# Altium schematic sheet 0239_GPU GDDR DEVICE DE.SchDoc
size 848 x 558 mm
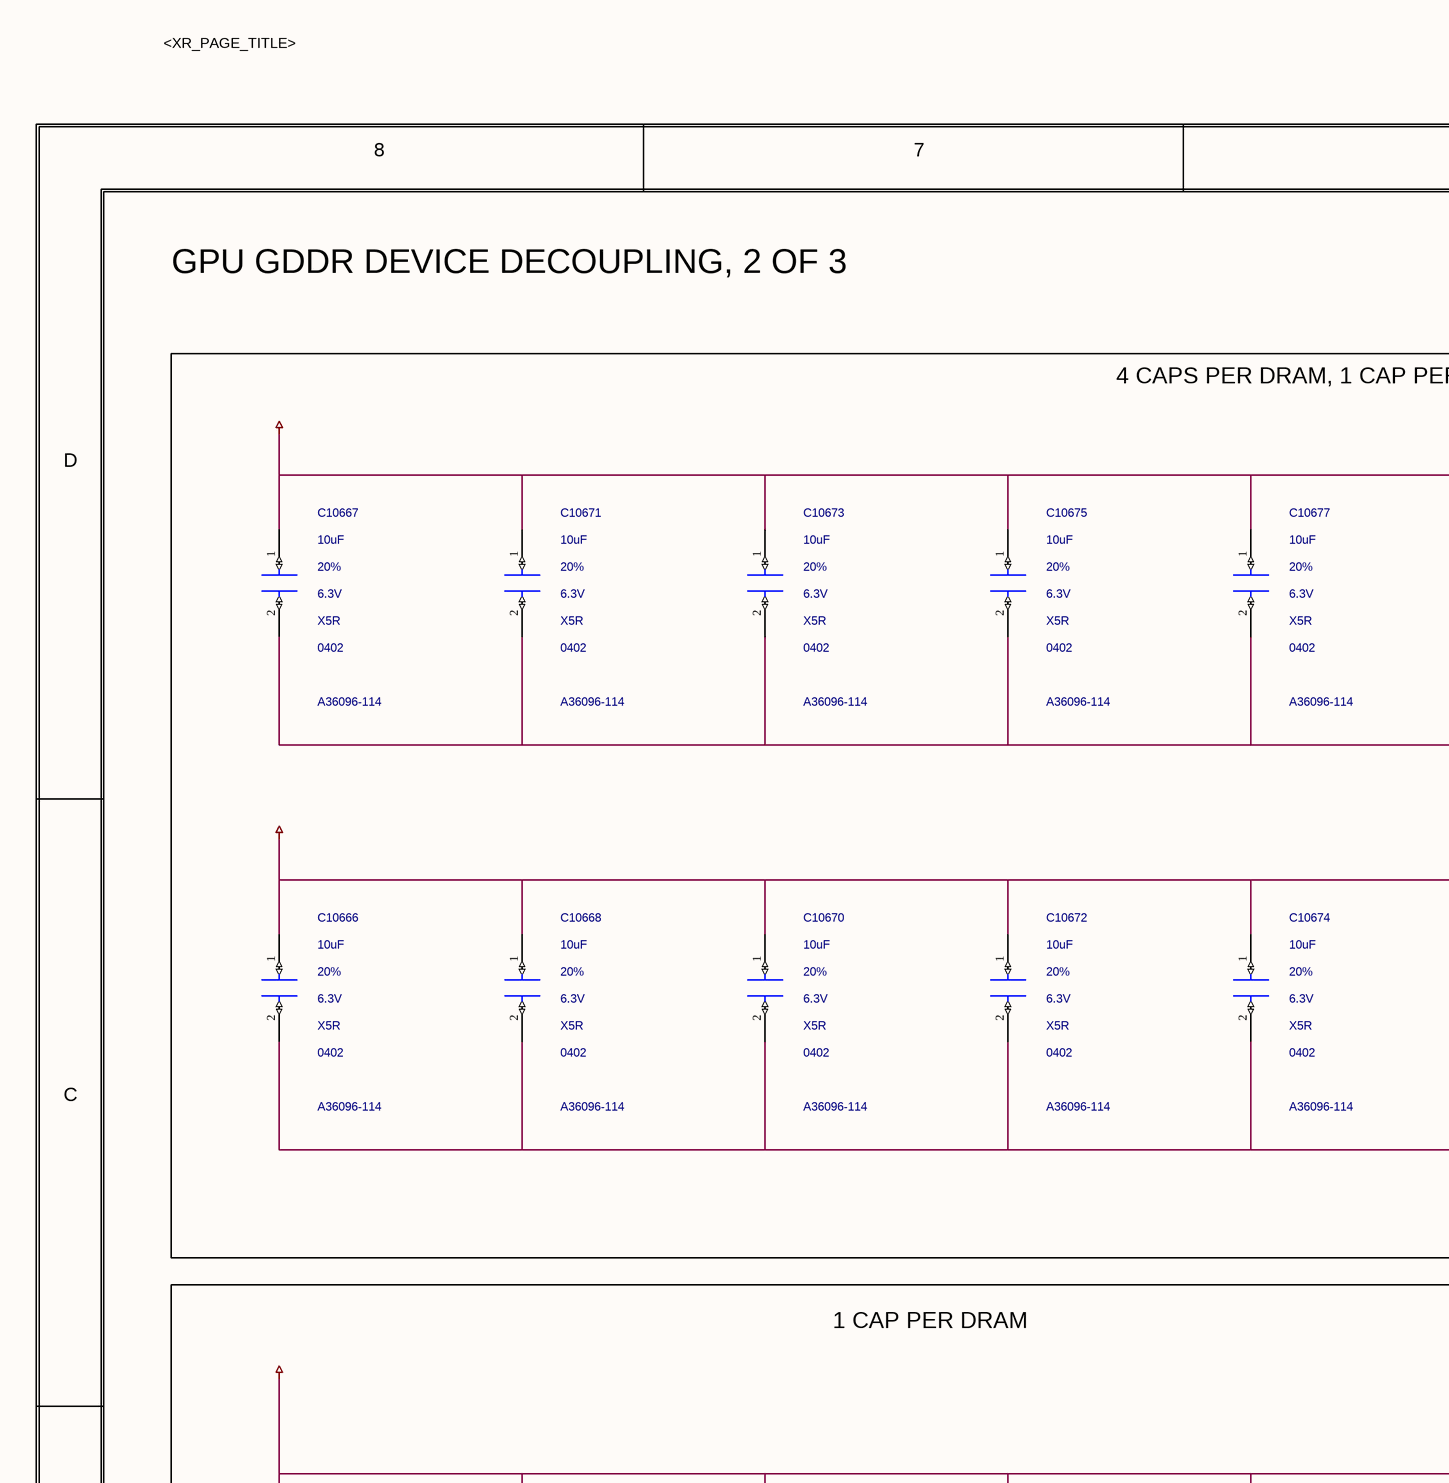
[diagram p0: 0239_GPU GDDR DEVICE DE.SchDoc, top left]
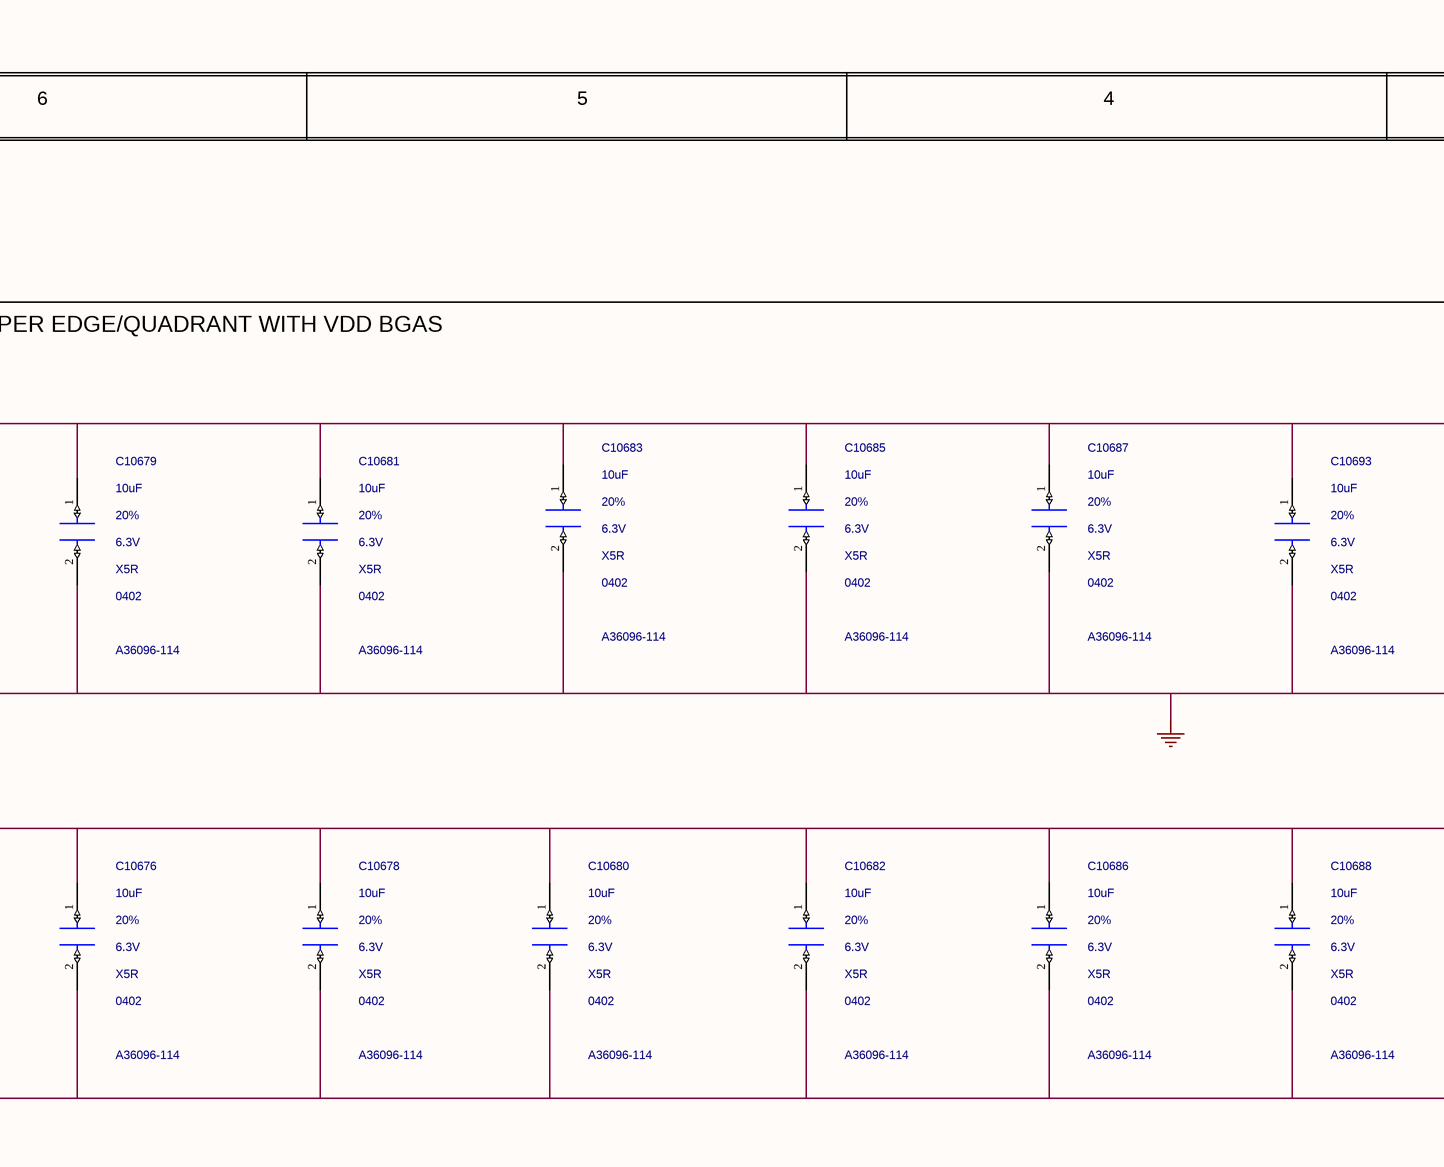
[diagram p1: 0239_GPU GDDR DEVICE DE.SchDoc, top middle]
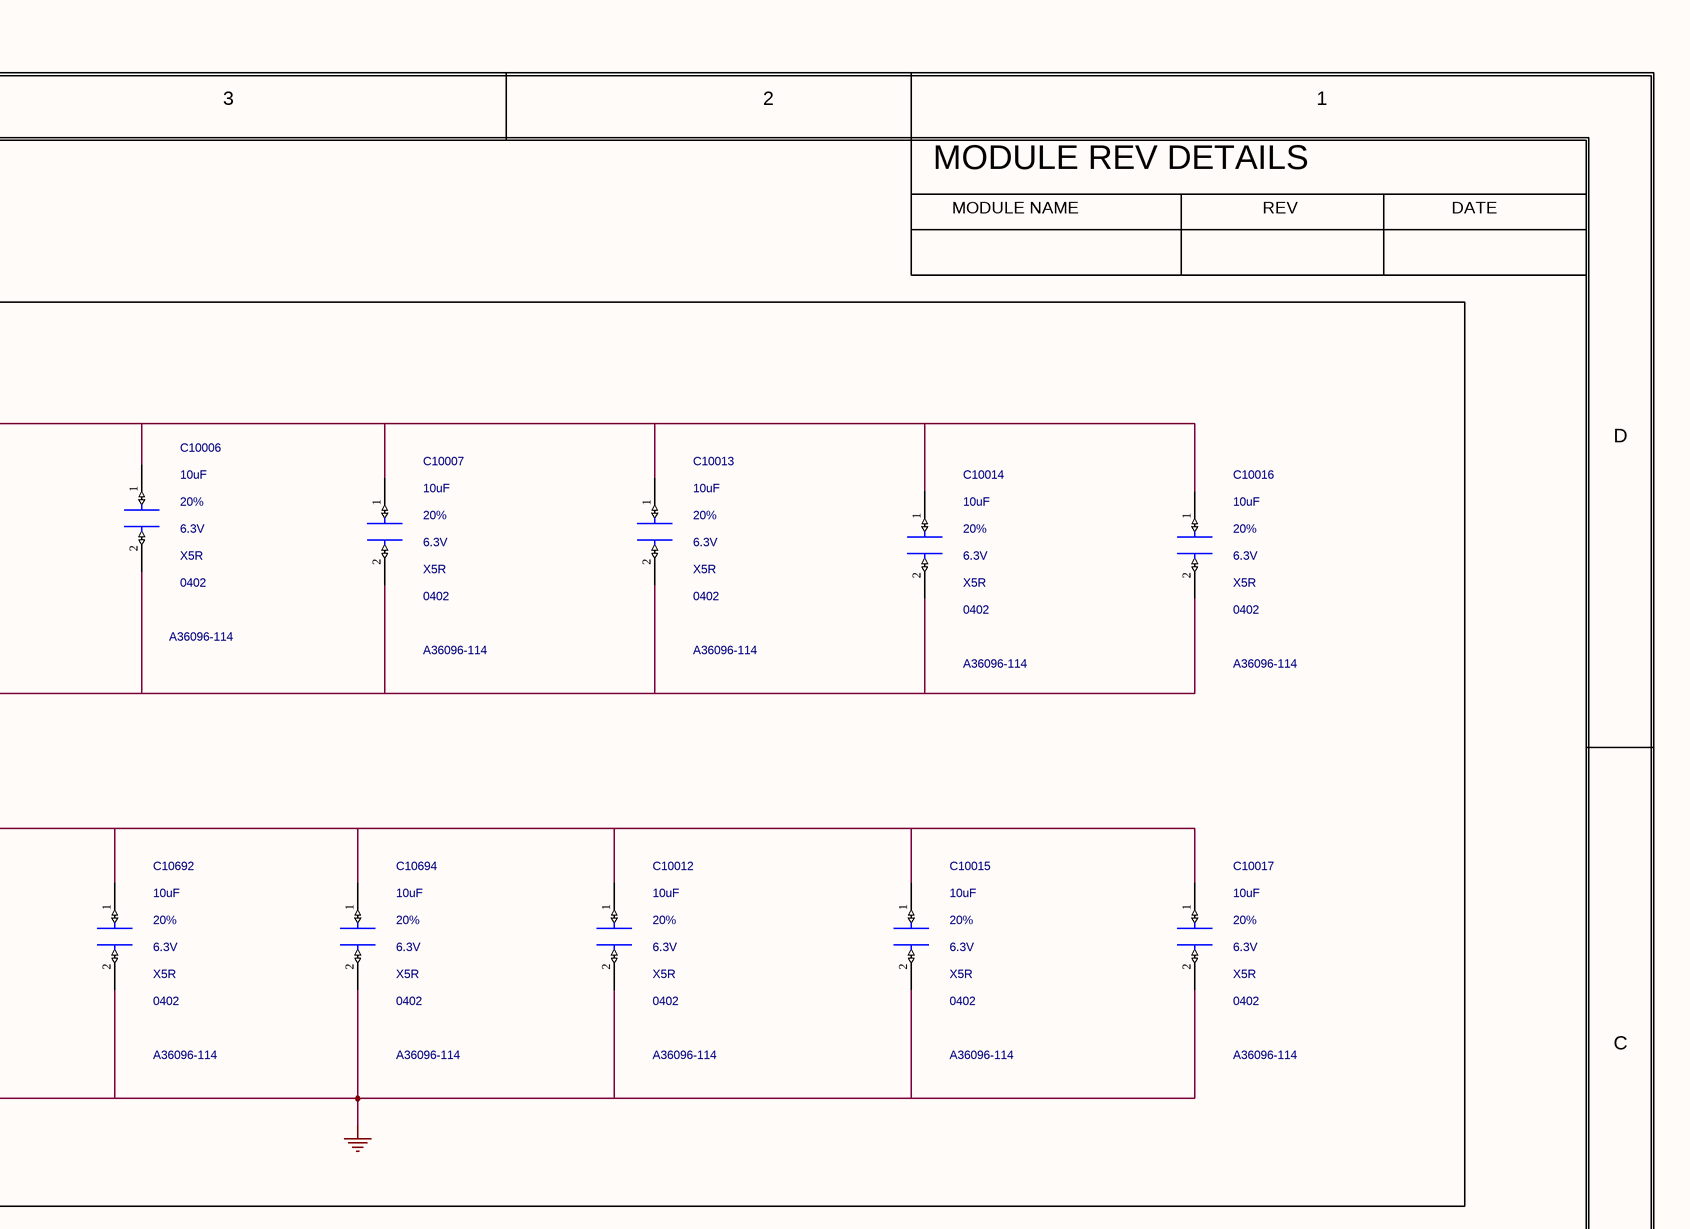
[diagram p2: 0239_GPU GDDR DEVICE DE.SchDoc, top right]
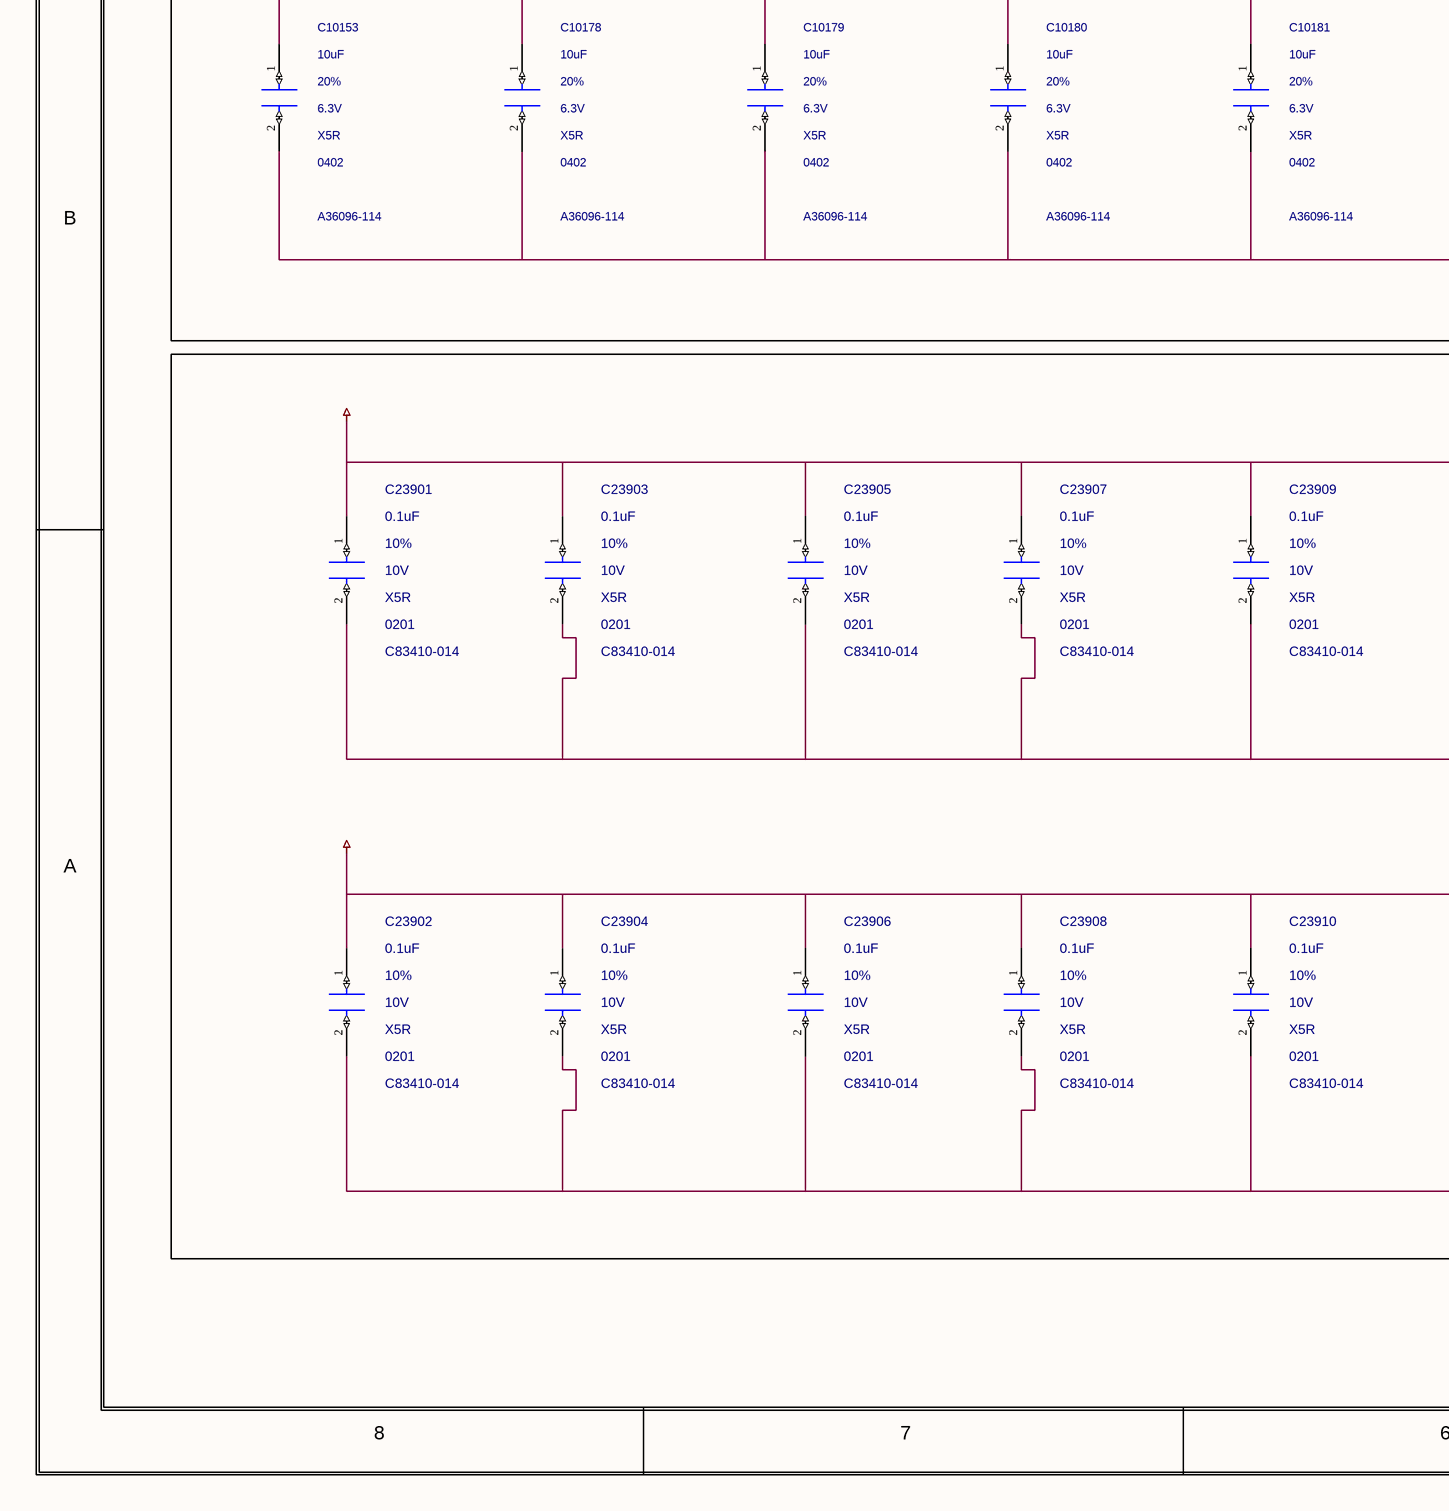
[diagram p3: 0239_GPU GDDR DEVICE DE.SchDoc, bottom left]
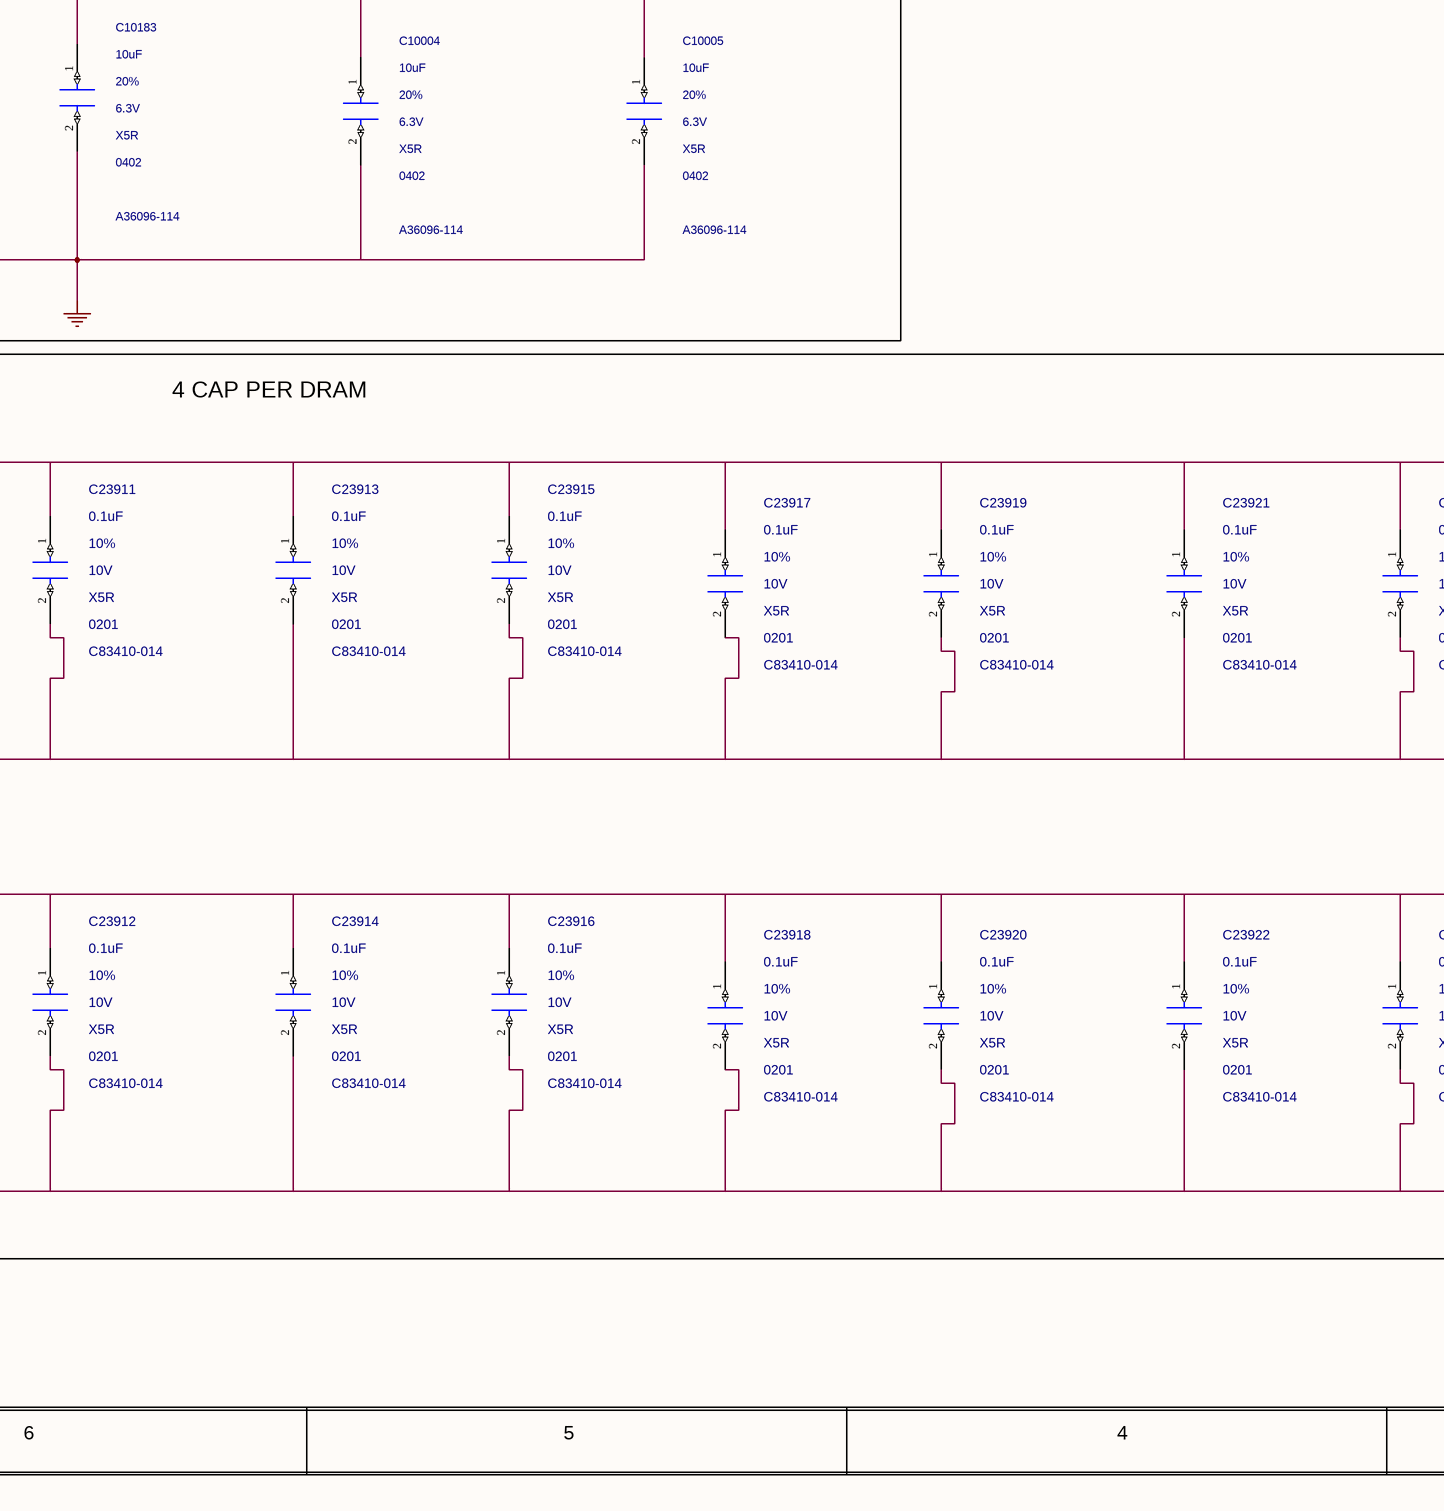
[diagram p4: 0239_GPU GDDR DEVICE DE.SchDoc, bottom middle]
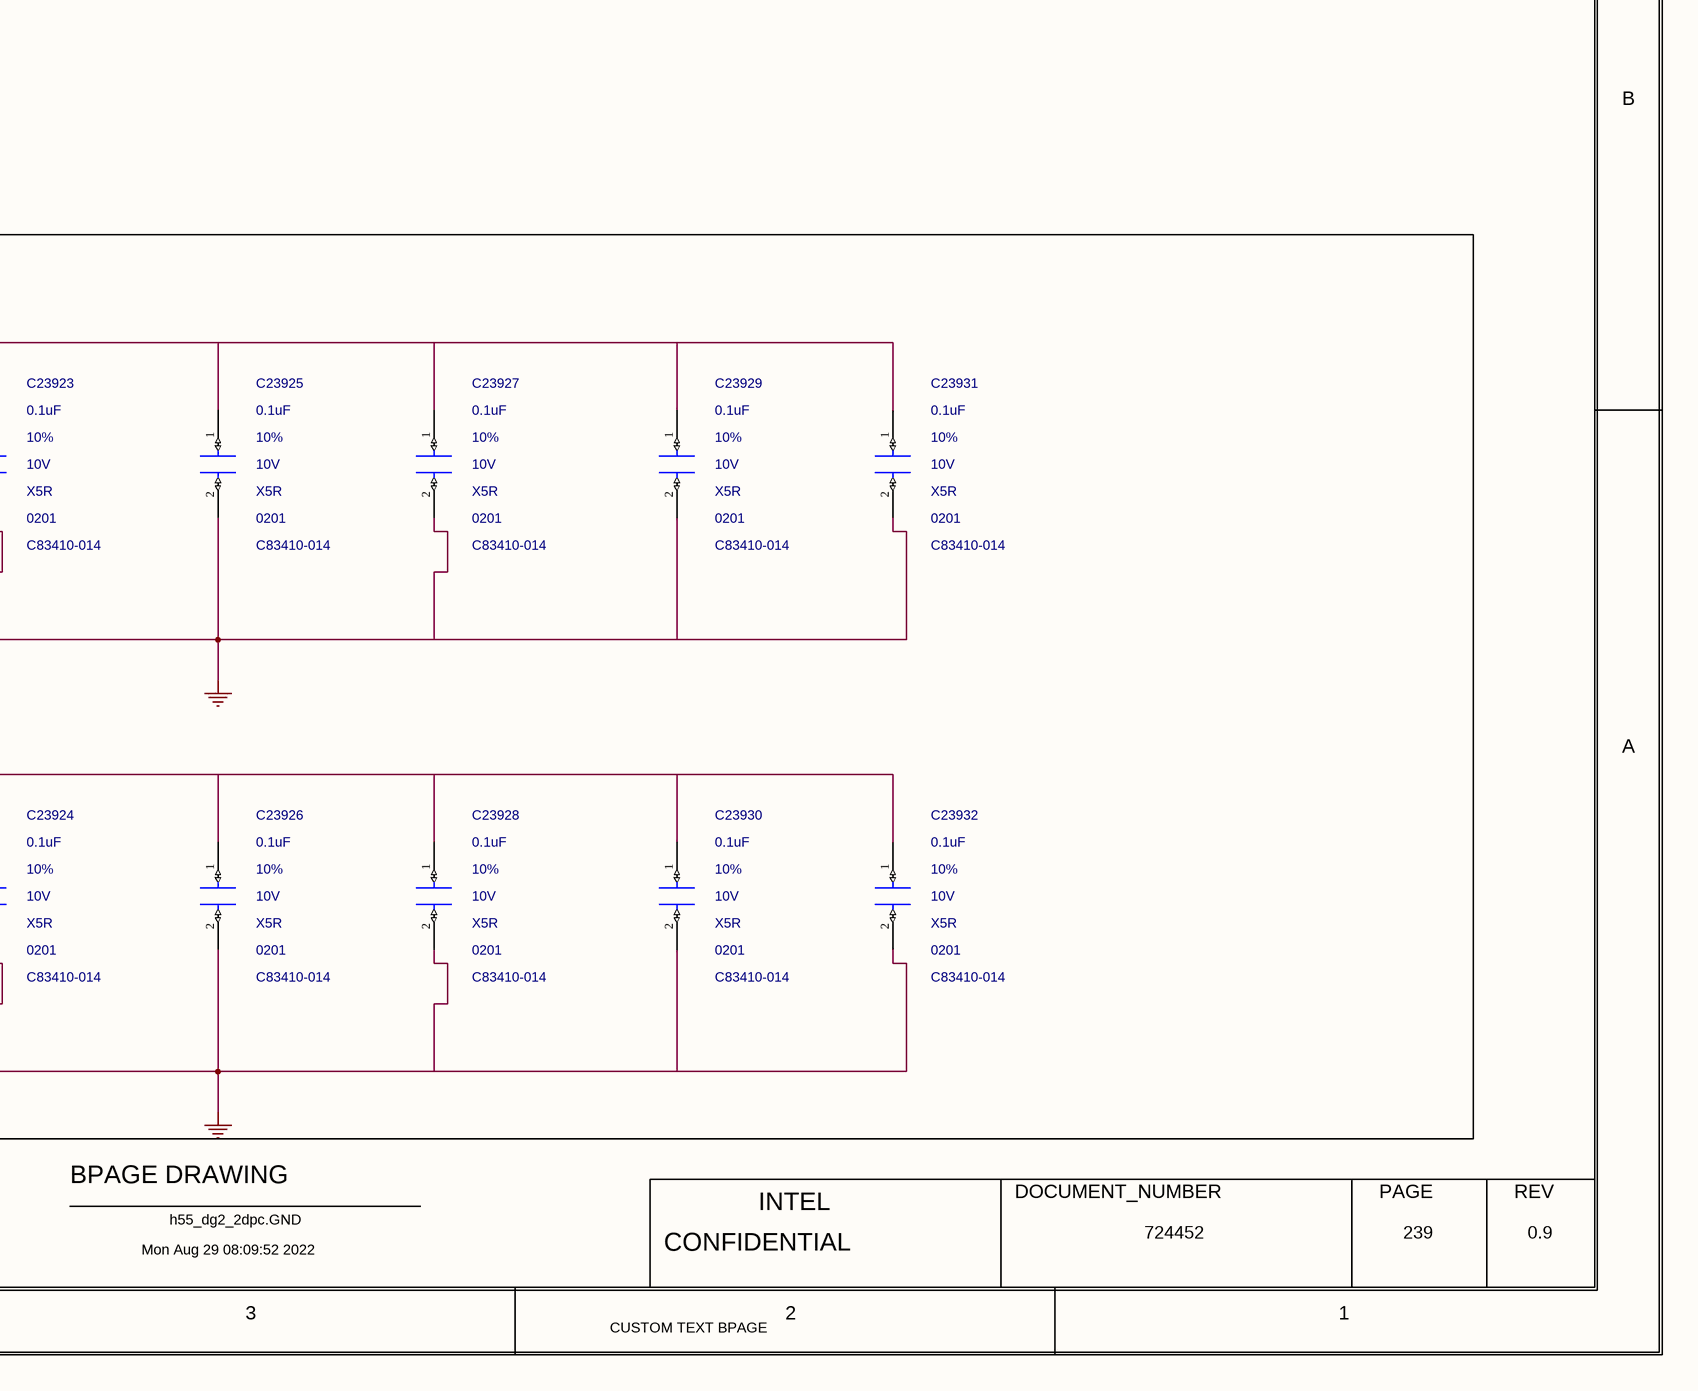
[diagram p5: 0239_GPU GDDR DEVICE DE.SchDoc, bottom right]

## Parts
C10004  10uF  MATERIAL: X5R  PACK_TYPE: 0402  PART_NUMBER: A36096-114  TOLERANCE: 20%  VOLTAGE: 6.3V  [SMC0402IA]
C10005  10uF  MATERIAL: X5R  PACK_TYPE: 0402  PART_NUMBER: A36096-114  TOLERANCE: 20%  VOLTAGE: 6.3V  [SMC0402IA]
C10006  10uF  MATERIAL: X5R  PACK_TYPE: 0402  PART_NUMBER: A36096-114  TOLERANCE: 20%  VOLTAGE: 6.3V  [SMC0402IA]
C10007  10uF  MATERIAL: X5R  PACK_TYPE: 0402  PART_NUMBER: A36096-114  TOLERANCE: 20%  VOLTAGE: 6.3V  [SMC0402IA]
C10012  10uF  MATERIAL: X5R  PACK_TYPE: 0402  PART_NUMBER: A36096-114  TOLERANCE: 20%  VOLTAGE: 6.3V  [SMC0402IA]
C10013  10uF  MATERIAL: X5R  PACK_TYPE: 0402  PART_NUMBER: A36096-114  TOLERANCE: 20%  VOLTAGE: 6.3V  [SMC0402IA]
C10014  10uF  MATERIAL: X5R  PACK_TYPE: 0402  PART_NUMBER: A36096-114  TOLERANCE: 20%  VOLTAGE: 6.3V  [SMC0402IA]
C10015  10uF  MATERIAL: X5R  PACK_TYPE: 0402  PART_NUMBER: A36096-114  TOLERANCE: 20%  VOLTAGE: 6.3V  [SMC0402IA]
C10016  10uF  MATERIAL: X5R  PACK_TYPE: 0402  PART_NUMBER: A36096-114  TOLERANCE: 20%  VOLTAGE: 6.3V  [SMC0402IA]
C10017  10uF  MATERIAL: X5R  PACK_TYPE: 0402  PART_NUMBER: A36096-114  TOLERANCE: 20%  VOLTAGE: 6.3V  [SMC0402IA]
C10153  10uF  MATERIAL: X5R  PACK_TYPE: 0402  PART_NUMBER: A36096-114  TOLERANCE: 20%  VOLTAGE: 6.3V  [SMC0402IA]
C10178  10uF  MATERIAL: X5R  PACK_TYPE: 0402  PART_NUMBER: A36096-114  TOLERANCE: 20%  VOLTAGE: 6.3V  [SMC0402IA]
C10179  10uF  MATERIAL: X5R  PACK_TYPE: 0402  PART_NUMBER: A36096-114  TOLERANCE: 20%  VOLTAGE: 6.3V  [SMC0402IA]
C10180  10uF  MATERIAL: X5R  PACK_TYPE: 0402  PART_NUMBER: A36096-114  TOLERANCE: 20%  VOLTAGE: 6.3V  [SMC0402IA]
C10181  10uF  MATERIAL: X5R  PACK_TYPE: 0402  PART_NUMBER: A36096-114  TOLERANCE: 20%  VOLTAGE: 6.3V  [SMC0402IA]
C10183  10uF  MATERIAL: X5R  PACK_TYPE: 0402  PART_NUMBER: A36096-114  TOLERANCE: 20%  VOLTAGE: 6.3V  [SMC0402IA]
C10666  10uF  MATERIAL: X5R  PACK_TYPE: 0402  PART_NUMBER: A36096-114  TOLERANCE: 20%  VOLTAGE: 6.3V  [SMC0402IA]
C10667  10uF  MATERIAL: X5R  PACK_TYPE: 0402  PART_NUMBER: A36096-114  TOLERANCE: 20%  VOLTAGE: 6.3V  [SMC0402IA]
C10668  10uF  MATERIAL: X5R  PACK_TYPE: 0402  PART_NUMBER: A36096-114  TOLERANCE: 20%  VOLTAGE: 6.3V  [SMC0402IA]
C10670  10uF  MATERIAL: X5R  PACK_TYPE: 0402  PART_NUMBER: A36096-114  TOLERANCE: 20%  VOLTAGE: 6.3V  [SMC0402IA]
C10671  10uF  MATERIAL: X5R  PACK_TYPE: 0402  PART_NUMBER: A36096-114  TOLERANCE: 20%  VOLTAGE: 6.3V  [SMC0402IA]
C10672  10uF  MATERIAL: X5R  PACK_TYPE: 0402  PART_NUMBER: A36096-114  TOLERANCE: 20%  VOLTAGE: 6.3V  [SMC0402IA]
C10673  10uF  MATERIAL: X5R  PACK_TYPE: 0402  PART_NUMBER: A36096-114  TOLERANCE: 20%  VOLTAGE: 6.3V  [SMC0402IA]
C10674  10uF  MATERIAL: X5R  PACK_TYPE: 0402  PART_NUMBER: A36096-114  TOLERANCE: 20%  VOLTAGE: 6.3V  [SMC0402IA]
C10675  10uF  MATERIAL: X5R  PACK_TYPE: 0402  PART_NUMBER: A36096-114  TOLERANCE: 20%  VOLTAGE: 6.3V  [SMC0402IA]
C10676  10uF  MATERIAL: X5R  PACK_TYPE: 0402  PART_NUMBER: A36096-114  TOLERANCE: 20%  VOLTAGE: 6.3V  [SMC0402IA]
C10677  10uF  MATERIAL: X5R  PACK_TYPE: 0402  PART_NUMBER: A36096-114  TOLERANCE: 20%  VOLTAGE: 6.3V  [SMC0402IA]
C10678  10uF  MATERIAL: X5R  PACK_TYPE: 0402  PART_NUMBER: A36096-114  TOLERANCE: 20%  VOLTAGE: 6.3V  [SMC0402IA]
C10679  10uF  MATERIAL: X5R  PACK_TYPE: 0402  PART_NUMBER: A36096-114  TOLERANCE: 20%  VOLTAGE: 6.3V  [SMC0402IA]
C10680  10uF  MATERIAL: X5R  PACK_TYPE: 0402  PART_NUMBER: A36096-114  TOLERANCE: 20%  VOLTAGE: 6.3V  [SMC0402IA]
C10681  10uF  MATERIAL: X5R  PACK_TYPE: 0402  PART_NUMBER: A36096-114  TOLERANCE: 20%  VOLTAGE: 6.3V  [SMC0402IA]
C10682  10uF  MATERIAL: X5R  PACK_TYPE: 0402  PART_NUMBER: A36096-114  TOLERANCE: 20%  VOLTAGE: 6.3V  [SMC0402IA]
C10683  10uF  MATERIAL: X5R  PACK_TYPE: 0402  PART_NUMBER: A36096-114  TOLERANCE: 20%  VOLTAGE: 6.3V  [SMC0402IA]
C10685  10uF  MATERIAL: X5R  PACK_TYPE: 0402  PART_NUMBER: A36096-114  TOLERANCE: 20%  VOLTAGE: 6.3V  [SMC0402IA]
C10686  10uF  MATERIAL: X5R  PACK_TYPE: 0402  PART_NUMBER: A36096-114  TOLERANCE: 20%  VOLTAGE: 6.3V  [SMC0402IA]
C10687  10uF  MATERIAL: X5R  PACK_TYPE: 0402  PART_NUMBER: A36096-114  TOLERANCE: 20%  VOLTAGE: 6.3V  [SMC0402IA]
C10688  10uF  MATERIAL: X5R  PACK_TYPE: 0402  PART_NUMBER: A36096-114  TOLERANCE: 20%  VOLTAGE: 6.3V  [SMC0402IA]
C10692  10uF  MATERIAL: X5R  PACK_TYPE: 0402  PART_NUMBER: A36096-114  TOLERANCE: 20%  VOLTAGE: 6.3V  [SMC0402IA]
C10693  10uF  MATERIAL: X5R  PACK_TYPE: 0402  PART_NUMBER: A36096-114  TOLERANCE: 20%  VOLTAGE: 6.3V  [SMC0402IA]
C10694  10uF  MATERIAL: X5R  PACK_TYPE: 0402  PART_NUMBER: A36096-114  TOLERANCE: 20%  VOLTAGE: 6.3V  [SMC0402IA]
C23901  0.1uF  MATERIAL: X5R  PACK_TYPE: 0201  PART_NUMBER: C83410-014  TOLERANCE: 10%  VOLTAGE: 10V  [SMC0201IA]
C23902  0.1uF  MATERIAL: X5R  PACK_TYPE: 0201  PART_NUMBER: C83410-014  TOLERANCE: 10%  VOLTAGE: 10V  [SMC0201IA]
C23903  0.1uF  MATERIAL: X5R  PACK_TYPE: 0201  PART_NUMBER: C83410-014  TOLERANCE: 10%  VOLTAGE: 10V  [SMC0201IA]
C23904  0.1uF  MATERIAL: X5R  PACK_TYPE: 0201  PART_NUMBER: C83410-014  TOLERANCE: 10%  VOLTAGE: 10V  [SMC0201IA]
C23905  0.1uF  MATERIAL: X5R  PACK_TYPE: 0201  PART_NUMBER: C83410-014  TOLERANCE: 10%  VOLTAGE: 10V  [SMC0201IA]
C23906  0.1uF  MATERIAL: X5R  PACK_TYPE: 0201  PART_NUMBER: C83410-014  TOLERANCE: 10%  VOLTAGE: 10V  [SMC0201IA]
C23907  0.1uF  MATERIAL: X5R  PACK_TYPE: 0201  PART_NUMBER: C83410-014  TOLERANCE: 10%  VOLTAGE: 10V  [SMC0201IA]
C23908  0.1uF  MATERIAL: X5R  PACK_TYPE: 0201  PART_NUMBER: C83410-014  TOLERANCE: 10%  VOLTAGE: 10V  [SMC0201IA]
C23909  0.1uF  MATERIAL: X5R  PACK_TYPE: 0201  PART_NUMBER: C83410-014  TOLERANCE: 10%  VOLTAGE: 10V  [SMC0201IA]
C23910  0.1uF  MATERIAL: X5R  PACK_TYPE: 0201  PART_NUMBER: C83410-014  TOLERANCE: 10%  VOLTAGE: 10V  [SMC0201IA]
C23911  0.1uF  MATERIAL: X5R  PACK_TYPE: 0201  PART_NUMBER: C83410-014  TOLERANCE: 10%  VOLTAGE: 10V  [SMC0201IA]
C23912  0.1uF  MATERIAL: X5R  PACK_TYPE: 0201  PART_NUMBER: C83410-014  TOLERANCE: 10%  VOLTAGE: 10V  [SMC0201IA]
C23913  0.1uF  MATERIAL: X5R  PACK_TYPE: 0201  PART_NUMBER: C83410-014  TOLERANCE: 10%  VOLTAGE: 10V  [SMC0201IA]
C23914  0.1uF  MATERIAL: X5R  PACK_TYPE: 0201  PART_NUMBER: C83410-014  TOLERANCE: 10%  VOLTAGE: 10V  [SMC0201IA]
C23915  0.1uF  MATERIAL: X5R  PACK_TYPE: 0201  PART_NUMBER: C83410-014  TOLERANCE: 10%  VOLTAGE: 10V  [SMC0201IA]
C23916  0.1uF  MATERIAL: X5R  PACK_TYPE: 0201  PART_NUMBER: C83410-014  TOLERANCE: 10%  VOLTAGE: 10V  [SMC0201IA]
C23917  0.1uF  MATERIAL: X5R  PACK_TYPE: 0201  PART_NUMBER: C83410-014  TOLERANCE: 10%  VOLTAGE: 10V  [SMC0201IA]
C23918  0.1uF  MATERIAL: X5R  PACK_TYPE: 0201  PART_NUMBER: C83410-014  TOLERANCE: 10%  VOLTAGE: 10V  [SMC0201IA]
C23919  0.1uF  MATERIAL: X5R  PACK_TYPE: 0201  PART_NUMBER: C83410-014  TOLERANCE: 10%  VOLTAGE: 10V  [SMC0201IA]
C23920  0.1uF  MATERIAL: X5R  PACK_TYPE: 0201  PART_NUMBER: C83410-014  TOLERANCE: 10%  VOLTAGE: 10V  [SMC0201IA]
C23921  0.1uF  MATERIAL: X5R  PACK_TYPE: 0201  PART_NUMBER: C83410-014  TOLERANCE: 10%  VOLTAGE: 10V  [SMC0201IA]
C23922  0.1uF  MATERIAL: X5R  PACK_TYPE: 0201  PART_NUMBER: C83410-014  TOLERANCE: 10%  VOLTAGE: 10V  [SMC0201IA]
C23923  0.1uF  MATERIAL: X5R  PACK_TYPE: 0201  PART_NUMBER: C83410-014  TOLERANCE: 10%  VOLTAGE: 10V  [SMC0201IA]
C23924  0.1uF  MATERIAL: X5R  PACK_TYPE: 0201  PART_NUMBER: C83410-014  TOLERANCE: 10%  VOLTAGE: 10V  [SMC0201IA]
C23925  0.1uF  MATERIAL: X5R  PACK_TYPE: 0201  PART_NUMBER: C83410-014  TOLERANCE: 10%  VOLTAGE: 10V  [SMC0201IA]
C23926  0.1uF  MATERIAL: X5R  PACK_TYPE: 0201  PART_NUMBER: C83410-014  TOLERANCE: 10%  VOLTAGE: 10V  [SMC0201IA]
C23927  0.1uF  MATERIAL: X5R  PACK_TYPE: 0201  PART_NUMBER: C83410-014  TOLERANCE: 10%  VOLTAGE: 10V  [SMC0201IA]
C23928  0.1uF  MATERIAL: X5R  PACK_TYPE: 0201  PART_NUMBER: C83410-014  TOLERANCE: 10%  VOLTAGE: 10V  [SMC0201IA]
C23929  0.1uF  MATERIAL: X5R  PACK_TYPE: 0201  PART_NUMBER: C83410-014  TOLERANCE: 10%  VOLTAGE: 10V  [SMC0201IA]
C23930  0.1uF  MATERIAL: X5R  PACK_TYPE: 0201  PART_NUMBER: C83410-014  TOLERANCE: 10%  VOLTAGE: 10V  [SMC0201IA]
C23931  0.1uF  MATERIAL: X5R  PACK_TYPE: 0201  PART_NUMBER: C83410-014  TOLERANCE: 10%  VOLTAGE: 10V  [SMC0201IA]
C23932  0.1uF  MATERIAL: X5R  PACK_TYPE: 0201  PART_NUMBER: C83410-014  TOLERANCE: 10%  VOLTAGE: 10V  [SMC0201IA]

## Blocks framed on the sheet
4 CAPS PER DRAM, 1 CAP PER EDGE/QUADRANT WITH VDD BGAS: C10006 C10007 C10012-C10017 C10666-C10668 C10670-C10683 C10685-C10688 C10692-C10694
1 CAP PER DRAM: C10004 C10005 C10153 C10178-C10181 C10183
4 CAP PER DRAM: C23901-C23932

## Nets
+V1P8S_GPU: C10004.1(A) C10005.1(A) C10153.1(A) C10178.1(A) C10179.1(A) C10180.1(A) C10181.1(A) C10183.1(A)
+VDD_GDDR6: C10006.1(A) C10007.1(A) C10012.1(A) C10013.1(A) C10014.1(A) C10015.1(A) C10016.1(A) C10017.1(A) C10666.1(A) C10667.1(A) C10668.1(A) C10670.1(A) C10671.1(A) C10672.1(A) C10673.1(A) C10674.1(A) C10675.1(A) C10676.1(A) C10677.1(A) C10678.1(A) C10679.1(A) C10680.1(A) C10681.1(A) C10682.1(A) C10683.1(A) C10685.1(A) C10686.1(A) C10687.1(A) C10688.1(A) C10692.1(A) C10693.1(A) C10694.1(A)
+VDDQ_GPU: C23901.1(A) C23902.1(A) C23903.1(A) C23904.1(A) C23905.1(A) C23906.1(A) C23907.1(A) C23908.1(A) C23909.1(A) C23910.1(A) C23911.1(A) C23912.1(A) C23913.1(A) C23914.1(A) C23915.1(A) C23916.1(A) C23917.1(A) C23918.1(A) C23919.1(A) C23920.1(A) C23921.1(A) C23922.1(A) C23923.1(A) C23924.1(A) C23925.1(A) C23926.1(A) C23927.1(A) C23928.1(A) C23929.1(A) C23930.1(A) C23931.1(A) C23932.1(A)
GND: C10004.2(B) C10005.2(B) C10006.2(B) C10007.2(B) C10012.2(B) C10013.2(B) C10014.2(B) C10015.2(B) C10016.2(B) C10017.2(B) C10153.2(B) C10178.2(B) C10179.2(B) C10180.2(B) C10181.2(B) C10183.2(B) C10666.2(B) C10667.2(B) C10668.2(B) C10670.2(B) C10671.2(B) C10672.2(B) C10673.2(B) C10674.2(B) C10675.2(B) C10676.2(B) C10677.2(B) C10678.2(B) C10679.2(B) C10680.2(B) C10681.2(B) C10682.2(B) C10683.2(B) C10685.2(B) C10686.2(B) C10687.2(B) C10688.2(B) C10692.2(B) C10693.2(B) C10694.2(B) C23901.2(B) C23902.2(B) C23903.2(B) C23904.2(B) C23905.2(B) C23906.2(B) C23907.2(B) C23908.2(B) C23909.2(B) C23910.2(B) C23911.2(B) C23912.2(B) C23913.2(B) C23914.2(B) C23915.2(B) C23916.2(B) C23917.2(B) C23918.2(B) C23919.2(B) C23920.2(B) C23921.2(B) C23922.2(B) C23923.2(B) C23924.2(B) C23925.2(B) C23926.2(B) C23927.2(B) C23928.2(B) C23929.2(B) C23930.2(B) C23931.2(B) C23932.2(B)

## Notes on the sheet
- <XR_PAGE_TITLE>
- 8
- 7
- 6
- 5
- 4
- 3
- 2
- 1
- MODULE REV DETAILS
- GPU GDDR DEVICE DECOUPLING, 2 OF 3
- MODULE NAME
- REV
- DATE
- D
- C
- B
- A
- BPAGE DRAWING
- INTEL
- DOCUMENT_NUMBER
- PAGE
- Mon Aug 29 08:09:52 2022
- h55_dg2_2dpc.GND
- CONFIDENTIAL
- 724452
- 239
- 0.9
- CUSTOM TEXT BPAGE

## Library data of the parts
C10004 = CAP: CDS_PHYS_PART_NAME: CAP_0402-A36096-114,X5R,10UF,6.3V,20%,LPDB,GENERIC; OriginalSymbolOrigin: (-50,25); XY: (-4900,2400); VER: 1; ROT: 0; PHYS_PAGE: 239; LOCATION: C10004; DRAWING: @RVP1_ADL_SB_ADP_S_DDR5_SODIMM_2DPC_LIB.H55_DG2_2DPC(SCH_1):PAGE410; CDS_LIB: discrete; PCB Footprint: SMC0402IA; CHIPS_PART_NAME: CAP; CDS_PART_NAME: CAP_0402-A36096-114,X5R,10UF,6.3V,20%,LPDB,GENERIC; CDS_LOCATION: C10004
C10005 = CAP: CDS_PHYS_PART_NAME: CAP_0402-A36096-114,X5R,10UF,6.3V,20%,LPDB,GENERIC; OriginalSymbolOrigin: (-50,25); XY: (-4375,2400); VER: 1; ROT: 0; PHYS_PAGE: 239; LOCATION: C10005; DRAWING: @RVP1_ADL_SB_ADP_S_DDR5_SODIMM_2DPC_LIB.H55_DG2_2DPC(SCH_1):PAGE410; CDS_LIB: discrete; PCB Footprint: SMC0402IA; CHIPS_PART_NAME: CAP; CDS_PART_NAME: CAP_0402-A36096-114,X5R,10UF,6.3V,20%,LPDB,GENERIC; CDS_LOCATION: C10005
C10006 = CAP: CDS_PHYS_PART_NAME: CAP_0402-A36096-114,X5R,10UF,6.3V,20%,LPDB,GENERIC; OriginalSymbolOrigin: (-50,25); XY: (-2675,4300); VER: 1; ROT: 0; PHYS_PAGE: 239; LOCATION: C10006; DRAWING: @RVP1_ADL_SB_ADP_S_DDR5_SODIMM_2DPC_LIB.H55_DG2_2DPC(SCH_1):PAGE410; CDS_LIB: discrete; PCB Footprint: SMC0402IA; CHIPS_PART_NAME: CAP; CDS_PART_NAME: CAP_0402-A36096-114,X5R,10UF,6.3V,20%,LPDB,GENERIC; CDS_LOCATION: C10006
C10007 = CAP: CDS_PHYS_PART_NAME: CAP_0402-A36096-114,X5R,10UF,6.3V,20%,LPDB,GENERIC; OriginalSymbolOrigin: (-50,25); XY: (-2225,4275); VER: 1; ROT: 0; PHYS_PAGE: 239; LOCATION: C10007; DRAWING: @RVP1_ADL_SB_ADP_S_DDR5_SODIMM_2DPC_LIB.H55_DG2_2DPC(SCH_1):PAGE410; CDS_LIB: discrete; PCB Footprint: SMC0402IA; CHIPS_PART_NAME: CAP; CDS_PART_NAME: CAP_0402-A36096-114,X5R,10UF,6.3V,20%,LPDB,GENERIC; CDS_LOCATION: C10007
C10012 = CAP: CDS_PHYS_PART_NAME: CAP_0402-A36096-114,X5R,10UF,6.3V,20%,LPDB,GENERIC; OriginalSymbolOrigin: (-50,25); XY: (-1800,3525); VER: 1; ROT: 0; PHYS_PAGE: 239; LOCATION: C10012; DRAWING: @RVP1_ADL_SB_ADP_S_DDR5_SODIMM_2DPC_LIB.H55_DG2_2DPC(SCH_1):PAGE410; CDS_LIB: discrete; PCB Footprint: SMC0402IA; CHIPS_PART_NAME: CAP; CDS_PART_NAME: CAP_0402-A36096-114,X5R,10UF,6.3V,20%,LPDB,GENERIC; CDS_LOCATION: C10012
C10013 = CAP: CDS_PHYS_PART_NAME: CAP_0402-A36096-114,X5R,10UF,6.3V,20%,LPDB,GENERIC; OriginalSymbolOrigin: (-50,25); XY: (-1725,4275); VER: 1; ROT: 0; PHYS_PAGE: 239; LOCATION: C10013; DRAWING: @RVP1_ADL_SB_ADP_S_DDR5_SODIMM_2DPC_LIB.H55_DG2_2DPC(SCH_1):PAGE410; CDS_LIB: discrete; PCB Footprint: SMC0402IA; CHIPS_PART_NAME: CAP; CDS_PART_NAME: CAP_0402-A36096-114,X5R,10UF,6.3V,20%,LPDB,GENERIC; CDS_LOCATION: C10013
C10014 = CAP: CDS_PHYS_PART_NAME: CAP_0402-A36096-114,X5R,10UF,6.3V,20%,LPDB,GENERIC; OriginalSymbolOrigin: (-50,25); XY: (-1225,4250); VER: 1; ROT: 0; PHYS_PAGE: 239; LOCATION: C10014; DRAWING: @RVP1_ADL_SB_ADP_S_DDR5_SODIMM_2DPC_LIB.H55_DG2_2DPC(SCH_1):PAGE410; CDS_LIB: discrete; PCB Footprint: SMC0402IA; CHIPS_PART_NAME: CAP; CDS_PART_NAME: CAP_0402-A36096-114,X5R,10UF,6.3V,20%,LPDB,GENERIC; CDS_LOCATION: C10014
C10015 = CAP: CDS_PHYS_PART_NAME: CAP_0402-A36096-114,X5R,10UF,6.3V,20%,LPDB,GENERIC; OriginalSymbolOrigin: (-50,25); XY: (-1250,3525); VER: 1; ROT: 0; PHYS_PAGE: 239; LOCATION: C10015; DRAWING: @RVP1_ADL_SB_ADP_S_DDR5_SODIMM_2DPC_LIB.H55_DG2_2DPC(SCH_1):PAGE410; CDS_LIB: discrete; PCB Footprint: SMC0402IA; CHIPS_PART_NAME: CAP; CDS_PART_NAME: CAP_0402-A36096-114,X5R,10UF,6.3V,20%,LPDB,GENERIC; CDS_LOCATION: C10015
C10016 = CAP: CDS_PHYS_PART_NAME: CAP_0402-A36096-114,X5R,10UF,6.3V,20%,LPDB,GENERIC; OriginalSymbolOrigin: (-50,25); XY: (-725,4250); VER: 1; ROT: 0; PHYS_PAGE: 239; LOCATION: C10016; DRAWING: @RVP1_ADL_SB_ADP_S_DDR5_SODIMM_2DPC_LIB.H55_DG2_2DPC(SCH_1):PAGE410; CDS_LIB: discrete; PCB Footprint: SMC0402IA; CHIPS_PART_NAME: CAP; CDS_PART_NAME: CAP_0402-A36096-114,X5R,10UF,6.3V,20%,LPDB,GENERIC; CDS_LOCATION: C10016
C10017 = CAP: CDS_PHYS_PART_NAME: CAP_0402-A36096-114,X5R,10UF,6.3V,20%,LPDB,GENERIC; OriginalSymbolOrigin: (-50,25); XY: (-725,3525); VER: 1; ROT: 0; PHYS_PAGE: 239; LOCATION: C10017; DRAWING: @RVP1_ADL_SB_ADP_S_DDR5_SODIMM_2DPC_LIB.H55_DG2_2DPC(SCH_1):PAGE410; CDS_LIB: discrete; PCB Footprint: SMC0402IA; CHIPS_PART_NAME: CAP; CDS_PART_NAME: CAP_0402-A36096-114,X5R,10UF,6.3V,20%,LPDB,GENERIC; CDS_LOCATION: C10017
C10153 = CAP: CDS_PHYS_PART_NAME: CAP_0402-A36096-114,X5R,10UF,6.3V,20%,LPDB,GENERIC; OriginalSymbolOrigin: (-50,25); XY: (-7675,2425); VER: 1; ROT: 0; PHYS_PAGE: 239; LOCATION: C10153; DRAWING: @RVP1_ADL_SB_ADP_S_DDR5_SODIMM_2DPC_LIB.H55_DG2_2DPC(SCH_1):PAGE410; CDS_LIB: discrete; PCB Footprint: SMC0402IA; CHIPS_PART_NAME: CAP; CDS_PART_NAME: CAP_0402-A36096-114,X5R,10UF,6.3V,20%,LPDB,GENERIC; CDS_LOCATION: C10153
C10178 = CAP: CDS_PHYS_PART_NAME: CAP_0402-A36096-114,X5R,10UF,6.3V,20%,LPDB,GENERIC; OriginalSymbolOrigin: (-50,25); XY: (-7225,2425); VER: 1; ROT: 0; PHYS_PAGE: 239; LOCATION: C10178; DRAWING: @RVP1_ADL_SB_ADP_S_DDR5_SODIMM_2DPC_LIB.H55_DG2_2DPC(SCH_1):PAGE410; CDS_LIB: discrete; PCB Footprint: SMC0402IA; CHIPS_PART_NAME: CAP; CDS_PART_NAME: CAP_0402-A36096-114,X5R,10UF,6.3V,20%,LPDB,GENERIC; CDS_LOCATION: C10178
C10179 = CAP: CDS_PHYS_PART_NAME: CAP_0402-A36096-114,X5R,10UF,6.3V,20%,LPDB,GENERIC; OriginalSymbolOrigin: (-50,25); XY: (-6775,2425); VER: 1; ROT: 0; PHYS_PAGE: 239; LOCATION: C10179; DRAWING: @RVP1_ADL_SB_ADP_S_DDR5_SODIMM_2DPC_LIB.H55_DG2_2DPC(SCH_1):PAGE410; CDS_LIB: discrete; PCB Footprint: SMC0402IA; CHIPS_PART_NAME: CAP; CDS_PART_NAME: CAP_0402-A36096-114,X5R,10UF,6.3V,20%,LPDB,GENERIC; CDS_LOCATION: C10179
C10180 = CAP: CDS_PHYS_PART_NAME: CAP_0402-A36096-114,X5R,10UF,6.3V,20%,LPDB,GENERIC; OriginalSymbolOrigin: (-50,25); XY: (-6325,2425); VER: 1; ROT: 0; PHYS_PAGE: 239; LOCATION: C10180; DRAWING: @RVP1_ADL_SB_ADP_S_DDR5_SODIMM_2DPC_LIB.H55_DG2_2DPC(SCH_1):PAGE410; CDS_LIB: discrete; PCB Footprint: SMC0402IA; CHIPS_PART_NAME: CAP; CDS_PART_NAME: CAP_0402-A36096-114,X5R,10UF,6.3V,20%,LPDB,GENERIC; CDS_LOCATION: C10180
C10181 = CAP: CDS_PHYS_PART_NAME: CAP_0402-A36096-114,X5R,10UF,6.3V,20%,LPDB,GENERIC; OriginalSymbolOrigin: (-50,25); XY: (-5875,2425); VER: 1; ROT: 0; PHYS_PAGE: 239; LOCATION: C10181; DRAWING: @RVP1_ADL_SB_ADP_S_DDR5_SODIMM_2DPC_LIB.H55_DG2_2DPC(SCH_1):PAGE410; CDS_LIB: discrete; PCB Footprint: SMC0402IA; CHIPS_PART_NAME: CAP; CDS_PART_NAME: CAP_0402-A36096-114,X5R,10UF,6.3V,20%,LPDB,GENERIC; CDS_LOCATION: C10181
C10183 = CAP: CDS_PHYS_PART_NAME: CAP_0402-A36096-114,X5R,10UF,6.3V,20%,LPDB,GENERIC; OriginalSymbolOrigin: (-50,25); XY: (-5425,2425); VER: 1; ROT: 0; PHYS_PAGE: 239; LOCATION: C10183; DRAWING: @RVP1_ADL_SB_ADP_S_DDR5_SODIMM_2DPC_LIB.H55_DG2_2DPC(SCH_1):PAGE410; CDS_LIB: discrete; PCB Footprint: SMC0402IA; CHIPS_PART_NAME: CAP; CDS_PART_NAME: CAP_0402-A36096-114,X5R,10UF,6.3V,20%,LPDB,GENERIC; CDS_LOCATION: C10183
C10666 = CAP: CDS_PHYS_PART_NAME: CAP_0402-A36096-114,X5R,10UF,6.3V,20%,LPDB,GENERIC; OriginalSymbolOrigin: (-50,25); XY: (-7675,3525); VER: 1; ROT: 0; PHYS_PAGE: 239; LOCATION: C10666; DRAWING: @RVP1_ADL_SB_ADP_S_DDR5_SODIMM_2DPC_LIB.H55_DG2_2DPC(SCH_1):PAGE410; CDS_LIB: discrete; PCB Footprint: SMC0402IA; CHIPS_PART_NAME: CAP; CDS_PART_NAME: CAP_0402-A36096-114,X5R,10UF,6.3V,20%,LPDB,GENERIC; CDS_LOCATION: C10666
C10667 = CAP: CDS_PHYS_PART_NAME: CAP_0402-A36096-114,X5R,10UF,6.3V,20%,LPDB,GENERIC; OriginalSymbolOrigin: (-50,25); XY: (-7675,4275); VER: 1; ROT: 0; PHYS_PAGE: 239; LOCATION: C10667; DRAWING: @RVP1_ADL_SB_ADP_S_DDR5_SODIMM_2DPC_LIB.H55_DG2_2DPC(SCH_1):PAGE410; CDS_LIB: discrete; PCB Footprint: SMC0402IA; CHIPS_PART_NAME: CAP; CDS_PART_NAME: CAP_0402-A36096-114,X5R,10UF,6.3V,20%,LPDB,GENERIC; CDS_LOCATION: C10667
C10668 = CAP: CDS_PHYS_PART_NAME: CAP_0402-A36096-114,X5R,10UF,6.3V,20%,LPDB,GENERIC; OriginalSymbolOrigin: (-50,25); XY: (-7225,3525); VER: 1; ROT: 0; PHYS_PAGE: 239; LOCATION: C10668; DRAWING: @RVP1_ADL_SB_ADP_S_DDR5_SODIMM_2DPC_LIB.H55_DG2_2DPC(SCH_1):PAGE410; CDS_LIB: discrete; PCB Footprint: SMC0402IA; CHIPS_PART_NAME: CAP; CDS_PART_NAME: CAP_0402-A36096-114,X5R,10UF,6.3V,20%,LPDB,GENERIC; CDS_LOCATION: C10668
C10670 = CAP: CDS_PHYS_PART_NAME: CAP_0402-A36096-114,X5R,10UF,6.3V,20%,LPDB,GENERIC; OriginalSymbolOrigin: (-50,25); XY: (-6775,3525); VER: 1; ROT: 0; PHYS_PAGE: 239; LOCATION: C10670; DRAWING: @RVP1_ADL_SB_ADP_S_DDR5_SODIMM_2DPC_LIB.H55_DG2_2DPC(SCH_1):PAGE410; CDS_LIB: discrete; PCB Footprint: SMC0402IA; CHIPS_PART_NAME: CAP; CDS_PART_NAME: CAP_0402-A36096-114,X5R,10UF,6.3V,20%,LPDB,GENERIC; CDS_LOCATION: C10670
C10671 = CAP: CDS_PHYS_PART_NAME: CAP_0402-A36096-114,X5R,10UF,6.3V,20%,LPDB,GENERIC; OriginalSymbolOrigin: (-50,25); XY: (-7225,4275); VER: 1; ROT: 0; PHYS_PAGE: 239; LOCATION: C10671; DRAWING: @RVP1_ADL_SB_ADP_S_DDR5_SODIMM_2DPC_LIB.H55_DG2_2DPC(SCH_1):PAGE410; CDS_LIB: discrete; PCB Footprint: SMC0402IA; CHIPS_PART_NAME: CAP; CDS_PART_NAME: CAP_0402-A36096-114,X5R,10UF,6.3V,20%,LPDB,GENERIC; CDS_LOCATION: C10671
C10672 = CAP: CDS_PHYS_PART_NAME: CAP_0402-A36096-114,X5R,10UF,6.3V,20%,LPDB,GENERIC; OriginalSymbolOrigin: (-50,25); XY: (-6325,3525); VER: 1; ROT: 0; PHYS_PAGE: 239; LOCATION: C10672; DRAWING: @RVP1_ADL_SB_ADP_S_DDR5_SODIMM_2DPC_LIB.H55_DG2_2DPC(SCH_1):PAGE410; CDS_LIB: discrete; PCB Footprint: SMC0402IA; CHIPS_PART_NAME: CAP; CDS_PART_NAME: CAP_0402-A36096-114,X5R,10UF,6.3V,20%,LPDB,GENERIC; CDS_LOCATION: C10672
C10673 = CAP: CDS_PHYS_PART_NAME: CAP_0402-A36096-114,X5R,10UF,6.3V,20%,LPDB,GENERIC; OriginalSymbolOrigin: (-50,25); XY: (-6775,4275); VER: 1; ROT: 0; PHYS_PAGE: 239; LOCATION: C10673; DRAWING: @RVP1_ADL_SB_ADP_S_DDR5_SODIMM_2DPC_LIB.H55_DG2_2DPC(SCH_1):PAGE410; CDS_LIB: discrete; PCB Footprint: SMC0402IA; CHIPS_PART_NAME: CAP; CDS_PART_NAME: CAP_0402-A36096-114,X5R,10UF,6.3V,20%,LPDB,GENERIC; CDS_LOCATION: C10673
C10674 = CAP: CDS_PHYS_PART_NAME: CAP_0402-A36096-114,X5R,10UF,6.3V,20%,LPDB,GENERIC; OriginalSymbolOrigin: (-50,25); XY: (-5875,3525); VER: 1; ROT: 0; PHYS_PAGE: 239; LOCATION: C10674; DRAWING: @RVP1_ADL_SB_ADP_S_DDR5_SODIMM_2DPC_LIB.H55_DG2_2DPC(SCH_1):PAGE410; CDS_LIB: discrete; PCB Footprint: SMC0402IA; CHIPS_PART_NAME: CAP; CDS_PART_NAME: CAP_0402-A36096-114,X5R,10UF,6.3V,20%,LPDB,GENERIC; CDS_LOCATION: C10674
C10675 = CAP: CDS_PHYS_PART_NAME: CAP_0402-A36096-114,X5R,10UF,6.3V,20%,LPDB,GENERIC; OriginalSymbolOrigin: (-50,25); XY: (-6325,4275); VER: 1; ROT: 0; PHYS_PAGE: 239; LOCATION: C10675; DRAWING: @RVP1_ADL_SB_ADP_S_DDR5_SODIMM_2DPC_LIB.H55_DG2_2DPC(SCH_1):PAGE410; CDS_LIB: discrete; PCB Footprint: SMC0402IA; CHIPS_PART_NAME: CAP; CDS_PART_NAME: CAP_0402-A36096-114,X5R,10UF,6.3V,20%,LPDB,GENERIC; CDS_LOCATION: C10675
C10676 = CAP: CDS_PHYS_PART_NAME: CAP_0402-A36096-114,X5R,10UF,6.3V,20%,LPDB,GENERIC; OriginalSymbolOrigin: (-50,25); XY: (-5425,3525); VER: 1; ROT: 0; PHYS_PAGE: 239; LOCATION: C10676; DRAWING: @RVP1_ADL_SB_ADP_S_DDR5_SODIMM_2DPC_LIB.H55_DG2_2DPC(SCH_1):PAGE410; CDS_LIB: discrete; PCB Footprint: SMC0402IA; CHIPS_PART_NAME: CAP; CDS_PART_NAME: CAP_0402-A36096-114,X5R,10UF,6.3V,20%,LPDB,GENERIC; CDS_LOCATION: C10676
C10677 = CAP: CDS_PHYS_PART_NAME: CAP_0402-A36096-114,X5R,10UF,6.3V,20%,LPDB,GENERIC; OriginalSymbolOrigin: (-50,25); XY: (-5875,4275); VER: 1; ROT: 0; PHYS_PAGE: 239; LOCATION: C10677; DRAWING: @RVP1_ADL_SB_ADP_S_DDR5_SODIMM_2DPC_LIB.H55_DG2_2DPC(SCH_1):PAGE410; CDS_LIB: discrete; PCB Footprint: SMC0402IA; CHIPS_PART_NAME: CAP; CDS_PART_NAME: CAP_0402-A36096-114,X5R,10UF,6.3V,20%,LPDB,GENERIC; CDS_LOCATION: C10677
C10678 = CAP: CDS_PHYS_PART_NAME: CAP_0402-A36096-114,X5R,10UF,6.3V,20%,LPDB,GENERIC; OriginalSymbolOrigin: (-50,25); XY: (-4975,3525); VER: 1; ROT: 0; PHYS_PAGE: 239; LOCATION: C10678; DRAWING: @RVP1_ADL_SB_ADP_S_DDR5_SODIMM_2DPC_LIB.H55_DG2_2DPC(SCH_1):PAGE410; CDS_LIB: discrete; PCB Footprint: SMC0402IA; CHIPS_PART_NAME: CAP; CDS_PART_NAME: CAP_0402-A36096-114,X5R,10UF,6.3V,20%,LPDB,GENERIC; CDS_LOCATION: C10678
C10679 = CAP: CDS_PHYS_PART_NAME: CAP_0402-A36096-114,X5R,10UF,6.3V,20%,LPDB,GENERIC; OriginalSymbolOrigin: (-50,25); XY: (-5425,4275); VER: 1; ROT: 0; PHYS_PAGE: 239; LOCATION: C10679; DRAWING: @RVP1_ADL_SB_ADP_S_DDR5_SODIMM_2DPC_LIB.H55_DG2_2DPC(SCH_1):PAGE410; CDS_LIB: discrete; PCB Footprint: SMC0402IA; CHIPS_PART_NAME: CAP; CDS_PART_NAME: CAP_0402-A36096-114,X5R,10UF,6.3V,20%,LPDB,GENERIC; CDS_LOCATION: C10679
C10680 = CAP: CDS_PHYS_PART_NAME: CAP_0402-A36096-114,X5R,10UF,6.3V,20%,LPDB,GENERIC; OriginalSymbolOrigin: (-50,25); XY: (-4550,3525); VER: 1; ROT: 0; PHYS_PAGE: 239; LOCATION: C10680; DRAWING: @RVP1_ADL_SB_ADP_S_DDR5_SODIMM_2DPC_LIB.H55_DG2_2DPC(SCH_1):PAGE410; CDS_LIB: discrete; PCB Footprint: SMC0402IA; CHIPS_PART_NAME: CAP; CDS_PART_NAME: CAP_0402-A36096-114,X5R,10UF,6.3V,20%,LPDB,GENERIC; CDS_LOCATION: C10680
C10681 = CAP: CDS_PHYS_PART_NAME: CAP_0402-A36096-114,X5R,10UF,6.3V,20%,LPDB,GENERIC; OriginalSymbolOrigin: (-50,25); XY: (-4975,4275); VER: 1; ROT: 0; PHYS_PAGE: 239; LOCATION: C10681; DRAWING: @RVP1_ADL_SB_ADP_S_DDR5_SODIMM_2DPC_LIB.H55_DG2_2DPC(SCH_1):PAGE410; CDS_LIB: discrete; PCB Footprint: SMC0402IA; CHIPS_PART_NAME: CAP; CDS_PART_NAME: CAP_0402-A36096-114,X5R,10UF,6.3V,20%,LPDB,GENERIC; CDS_LOCATION: C10681
C10682 = CAP: CDS_PHYS_PART_NAME: CAP_0402-A36096-114,X5R,10UF,6.3V,20%,LPDB,GENERIC; OriginalSymbolOrigin: (-50,25); XY: (-4075,3525); VER: 1; ROT: 0; PHYS_PAGE: 239; LOCATION: C10682; DRAWING: @RVP1_ADL_SB_ADP_S_DDR5_SODIMM_2DPC_LIB.H55_DG2_2DPC(SCH_1):PAGE410; CDS_LIB: discrete; PCB Footprint: SMC0402IA; CHIPS_PART_NAME: CAP; CDS_PART_NAME: CAP_0402-A36096-114,X5R,10UF,6.3V,20%,LPDB,GENERIC; CDS_LOCATION: C10682
C10683 = CAP: CDS_PHYS_PART_NAME: CAP_0402-A36096-114,X5R,10UF,6.3V,20%,LPDB,GENERIC; OriginalSymbolOrigin: (-50,25); XY: (-4525,4300); VER: 1; ROT: 0; PHYS_PAGE: 239; LOCATION: C10683; DRAWING: @RVP1_ADL_SB_ADP_S_DDR5_SODIMM_2DPC_LIB.H55_DG2_2DPC(SCH_1):PAGE410; CDS_LIB: discrete; PCB Footprint: SMC0402IA; CHIPS_PART_NAME: CAP; CDS_PART_NAME: CAP_0402-A36096-114,X5R,10UF,6.3V,20%,LPDB,GENERIC; CDS_LOCATION: C10683
C10685 = CAP: CDS_PHYS_PART_NAME: CAP_0402-A36096-114,X5R,10UF,6.3V,20%,LPDB,GENERIC; OriginalSymbolOrigin: (-50,25); XY: (-4075,4300); VER: 1; ROT: 0; PHYS_PAGE: 239; LOCATION: C10685; DRAWING: @RVP1_ADL_SB_ADP_S_DDR5_SODIMM_2DPC_LIB.H55_DG2_2DPC(SCH_1):PAGE410; CDS_LIB: discrete; PCB Footprint: SMC0402IA; CHIPS_PART_NAME: CAP; CDS_PART_NAME: CAP_0402-A36096-114,X5R,10UF,6.3V,20%,LPDB,GENERIC; CDS_LOCATION: C10685
C10686 = CAP: CDS_PHYS_PART_NAME: CAP_0402-A36096-114,X5R,10UF,6.3V,20%,LPDB,GENERIC; OriginalSymbolOrigin: (-50,25); XY: (-3625,3525); VER: 1; ROT: 0; PHYS_PAGE: 239; LOCATION: C10686; DRAWING: @RVP1_ADL_SB_ADP_S_DDR5_SODIMM_2DPC_LIB.H55_DG2_2DPC(SCH_1):PAGE410; CDS_LIB: discrete; PCB Footprint: SMC0402IA; CHIPS_PART_NAME: CAP; CDS_PART_NAME: CAP_0402-A36096-114,X5R,10UF,6.3V,20%,LPDB,GENERIC; CDS_LOCATION: C10686
C10687 = CAP: CDS_PHYS_PART_NAME: CAP_0402-A36096-114,X5R,10UF,6.3V,20%,LPDB,GENERIC; OriginalSymbolOrigin: (-50,25); XY: (-3625,4300); VER: 1; ROT: 0; PHYS_PAGE: 239; LOCATION: C10687; DRAWING: @RVP1_ADL_SB_ADP_S_DDR5_SODIMM_2DPC_LIB.H55_DG2_2DPC(SCH_1):PAGE410; CDS_LIB: discrete; PCB Footprint: SMC0402IA; CHIPS_PART_NAME: CAP; CDS_PART_NAME: CAP_0402-A36096-114,X5R,10UF,6.3V,20%,LPDB,GENERIC; CDS_LOCATION: C10687
C10688 = CAP: CDS_PHYS_PART_NAME: CAP_0402-A36096-114,X5R,10UF,6.3V,20%,LPDB,GENERIC; OriginalSymbolOrigin: (-50,25); XY: (-3175,3525); VER: 1; ROT: 0; PHYS_PAGE: 239; LOCATION: C10688; DRAWING: @RVP1_ADL_SB_ADP_S_DDR5_SODIMM_2DPC_LIB.H55_DG2_2DPC(SCH_1):PAGE410; CDS_LIB: discrete; PCB Footprint: SMC0402IA; CHIPS_PART_NAME: CAP; CDS_PART_NAME: CAP_0402-A36096-114,X5R,10UF,6.3V,20%,LPDB,GENERIC; CDS_LOCATION: C10688
C10692 = CAP: CDS_PHYS_PART_NAME: CAP_0402-A36096-114,X5R,10UF,6.3V,20%,LPDB,GENERIC; OriginalSymbolOrigin: (-50,25); XY: (-2725,3525); VER: 1; ROT: 0; PHYS_PAGE: 239; LOCATION: C10692; DRAWING: @RVP1_ADL_SB_ADP_S_DDR5_SODIMM_2DPC_LIB.H55_DG2_2DPC(SCH_1):PAGE410; CDS_LIB: discrete; PCB Footprint: SMC0402IA; CHIPS_PART_NAME: CAP; CDS_PART_NAME: CAP_0402-A36096-114,X5R,10UF,6.3V,20%,LPDB,GENERIC; CDS_LOCATION: C10692
C10693 = CAP: CDS_PHYS_PART_NAME: CAP_0402-A36096-114,X5R,10UF,6.3V,20%,LPDB,GENERIC; OriginalSymbolOrigin: (-50,25); XY: (-3175,4275); VER: 1; ROT: 0; PHYS_PAGE: 239; LOCATION: C10693; DRAWING: @RVP1_ADL_SB_ADP_S_DDR5_SODIMM_2DPC_LIB.H55_DG2_2DPC(SCH_1):PAGE410; CDS_LIB: discrete; PCB Footprint: SMC0402IA; CHIPS_PART_NAME: CAP; CDS_PART_NAME: CAP_0402-A36096-114,X5R,10UF,6.3V,20%,LPDB,GENERIC; CDS_LOCATION: C10693
C10694 = CAP: CDS_PHYS_PART_NAME: CAP_0402-A36096-114,X5R,10UF,6.3V,20%,LPDB,GENERIC; OriginalSymbolOrigin: (-50,25); XY: (-2275,3525); VER: 1; ROT: 0; PHYS_PAGE: 239; LOCATION: C10694; DRAWING: @RVP1_ADL_SB_ADP_S_DDR5_SODIMM_2DPC_LIB.H55_DG2_2DPC(SCH_1):PAGE410; CDS_LIB: discrete; PCB Footprint: SMC0402IA; CHIPS_PART_NAME: CAP; CDS_PART_NAME: CAP_0402-A36096-114,X5R,10UF,6.3V,20%,LPDB,GENERIC; CDS_LOCATION: C10694
C23901 = CAP: CDS_PHYS_PART_NAME: CAP_0201-C83410-014,X5R,0.1UF,10V,10%,LPDB,GENERIC; OriginalSymbolOrigin: (-50,25); XY: (-7550,1550); VER: 1; ROT: 0; PHYS_PAGE: 239; LOCATION: C23901; IP: GENERIC; FP_TECH: LPDB; DRAWING: @RVP1_ADL_SB_ADP_S_DDR5_SODIMM_2DPC_LIB.H55_DG2_2DPC(SCH_1):PAGE410; CDS_LIB: discrete; PCB Footprint: SMC0201IA; CHIPS_PART_NAME: CAP; CDS_PART_NAME: CAP_0201-C83410-014,X5R,0.1UF,10V,10%,LPDB,GENERIC; CDS_LOCATION: C23901
C23902 = CAP: CDS_PHYS_PART_NAME: CAP_0201-C83410-014,X5R,0.1UF,10V,10%,LPDB,GENERIC; OriginalSymbolOrigin: (-50,25); XY: (-7550,750); VER: 1; ROT: 0; PHYS_PAGE: 239; LOCATION: C23902; IP: GENERIC; FP_TECH: LPDB; DRAWING: @RVP1_ADL_SB_ADP_S_DDR5_SODIMM_2DPC_LIB.H55_DG2_2DPC(SCH_1):PAGE410; CDS_LIB: discrete; PCB Footprint: SMC0201IA; CHIPS_PART_NAME: CAP; CDS_PART_NAME: CAP_0201-C83410-014,X5R,0.1UF,10V,10%,LPDB,GENERIC; CDS_LOCATION: C23902
C23903 = CAP: CDS_PHYS_PART_NAME: CAP_0201-C83410-014,X5R,0.1UF,10V,10%,LPDB,GENERIC; OriginalSymbolOrigin: (-50,25); XY: (-7150,1550); VER: 1; ROT: 0; PHYS_PAGE: 239; LOCATION: C23903; IP: GENERIC; FP_TECH: LPDB; DRAWING: @RVP1_ADL_SB_ADP_S_DDR5_SODIMM_2DPC_LIB.H55_DG2_2DPC(SCH_1):PAGE410; CDS_LIB: discrete; PCB Footprint: SMC0201IA; CHIPS_PART_NAME: CAP; CDS_PART_NAME: CAP_0201-C83410-014,X5R,0.1UF,10V,10%,LPDB,GENERIC; CDS_LOCATION: C23903
C23904 = CAP: CDS_PHYS_PART_NAME: CAP_0201-C83410-014,X5R,0.1UF,10V,10%,LPDB,GENERIC; OriginalSymbolOrigin: (-50,25); XY: (-7150,750); VER: 1; ROT: 0; PHYS_PAGE: 239; LOCATION: C23904; IP: GENERIC; FP_TECH: LPDB; DRAWING: @RVP1_ADL_SB_ADP_S_DDR5_SODIMM_2DPC_LIB.H55_DG2_2DPC(SCH_1):PAGE410; CDS_LIB: discrete; PCB Footprint: SMC0201IA; CHIPS_PART_NAME: CAP; CDS_PART_NAME: CAP_0201-C83410-014,X5R,0.1UF,10V,10%,LPDB,GENERIC; CDS_LOCATION: C23904
C23905 = CAP: CDS_PHYS_PART_NAME: CAP_0201-C83410-014,X5R,0.1UF,10V,10%,LPDB,GENERIC; OriginalSymbolOrigin: (-50,25); XY: (-6700,1550); VER: 1; ROT: 0; PHYS_PAGE: 239; LOCATION: C23905; IP: GENERIC; FP_TECH: LPDB; DRAWING: @RVP1_ADL_SB_ADP_S_DDR5_SODIMM_2DPC_LIB.H55_DG2_2DPC(SCH_1):PAGE410; CDS_LIB: discrete; PCB Footprint: SMC0201IA; CHIPS_PART_NAME: CAP; CDS_PART_NAME: CAP_0201-C83410-014,X5R,0.1UF,10V,10%,LPDB,GENERIC; CDS_LOCATION: C23905
C23906 = CAP: CDS_PHYS_PART_NAME: CAP_0201-C83410-014,X5R,0.1UF,10V,10%,LPDB,GENERIC; OriginalSymbolOrigin: (-50,25); XY: (-6700,750); VER: 1; ROT: 0; PHYS_PAGE: 239; LOCATION: C23906; IP: GENERIC; FP_TECH: LPDB; DRAWING: @RVP1_ADL_SB_ADP_S_DDR5_SODIMM_2DPC_LIB.H55_DG2_2DPC(SCH_1):PAGE410; CDS_LIB: discrete; PCB Footprint: SMC0201IA; CHIPS_PART_NAME: CAP; CDS_PART_NAME: CAP_0201-C83410-014,X5R,0.1UF,10V,10%,LPDB,GENERIC; CDS_LOCATION: C23906
C23907 = CAP: CDS_PHYS_PART_NAME: CAP_0201-C83410-014,X5R,0.1UF,10V,10%,LPDB,GENERIC; OriginalSymbolOrigin: (-50,25); XY: (-6300,1550); VER: 1; ROT: 0; PHYS_PAGE: 239; LOCATION: C23907; IP: GENERIC; FP_TECH: LPDB; DRAWING: @RVP1_ADL_SB_ADP_S_DDR5_SODIMM_2DPC_LIB.H55_DG2_2DPC(SCH_1):PAGE410; CDS_LIB: discrete; PCB Footprint: SMC0201IA; CHIPS_PART_NAME: CAP; CDS_PART_NAME: CAP_0201-C83410-014,X5R,0.1UF,10V,10%,LPDB,GENERIC; CDS_LOCATION: C23907
C23908 = CAP: CDS_PHYS_PART_NAME: CAP_0201-C83410-014,X5R,0.1UF,10V,10%,LPDB,GENERIC; OriginalSymbolOrigin: (-50,25); XY: (-6300,750); VER: 1; ROT: 0; PHYS_PAGE: 239; LOCATION: C23908; IP: GENERIC; FP_TECH: LPDB; DRAWING: @RVP1_ADL_SB_ADP_S_DDR5_SODIMM_2DPC_LIB.H55_DG2_2DPC(SCH_1):PAGE410; CDS_LIB: discrete; PCB Footprint: SMC0201IA; CHIPS_PART_NAME: CAP; CDS_PART_NAME: CAP_0201-C83410-014,X5R,0.1UF,10V,10%,LPDB,GENERIC; CDS_LOCATION: C23908
C23909 = CAP: CDS_PHYS_PART_NAME: CAP_0201-C83410-014,X5R,0.1UF,10V,10%,LPDB,GENERIC; OriginalSymbolOrigin: (-50,25); XY: (-5875,1550); VER: 1; ROT: 0; PHYS_PAGE: 239; LOCATION: C23909; IP: GENERIC; FP_TECH: LPDB; DRAWING: @RVP1_ADL_SB_ADP_S_DDR5_SODIMM_2DPC_LIB.H55_DG2_2DPC(SCH_1):PAGE410; CDS_LIB: discrete; PCB Footprint: SMC0201IA; CHIPS_PART_NAME: CAP; CDS_PART_NAME: CAP_0201-C83410-014,X5R,0.1UF,10V,10%,LPDB,GENERIC; CDS_LOCATION: C23909
C23910 = CAP: CDS_PHYS_PART_NAME: CAP_0201-C83410-014,X5R,0.1UF,10V,10%,LPDB,GENERIC; OriginalSymbolOrigin: (-50,25); XY: (-5875,750); VER: 1; ROT: 0; PHYS_PAGE: 239; LOCATION: C23910; IP: GENERIC; FP_TECH: LPDB; DRAWING: @RVP1_ADL_SB_ADP_S_DDR5_SODIMM_2DPC_LIB.H55_DG2_2DPC(SCH_1):PAGE410; CDS_LIB: discrete; PCB Footprint: SMC0201IA; CHIPS_PART_NAME: CAP; CDS_PART_NAME: CAP_0201-C83410-014,X5R,0.1UF,10V,10%,LPDB,GENERIC; CDS_LOCATION: C23910
C23911 = CAP: CDS_PHYS_PART_NAME: CAP_0201-C83410-014,X5R,0.1UF,10V,10%,LPDB,GENERIC; OriginalSymbolOrigin: (-50,25); XY: (-5475,1550); VER: 1; ROT: 0; PHYS_PAGE: 239; LOCATION: C23911; IP: GENERIC; FP_TECH: LPDB; DRAWING: @RVP1_ADL_SB_ADP_S_DDR5_SODIMM_2DPC_LIB.H55_DG2_2DPC(SCH_1):PAGE410; CDS_LIB: discrete; PCB Footprint: SMC0201IA; CHIPS_PART_NAME: CAP; CDS_PART_NAME: CAP_0201-C83410-014,X5R,0.1UF,10V,10%,LPDB,GENERIC; CDS_LOCATION: C23911
C23912 = CAP: CDS_PHYS_PART_NAME: CAP_0201-C83410-014,X5R,0.1UF,10V,10%,LPDB,GENERIC; OriginalSymbolOrigin: (-50,25); XY: (-5475,750); VER: 1; ROT: 0; PHYS_PAGE: 239; LOCATION: C23912; IP: GENERIC; FP_TECH: LPDB; DRAWING: @RVP1_ADL_SB_ADP_S_DDR5_SODIMM_2DPC_LIB.H55_DG2_2DPC(SCH_1):PAGE410; CDS_LIB: discrete; PCB Footprint: SMC0201IA; CHIPS_PART_NAME: CAP; CDS_PART_NAME: CAP_0201-C83410-014,X5R,0.1UF,10V,10%,LPDB,GENERIC; CDS_LOCATION: C23912
C23913 = CAP: CDS_PHYS_PART_NAME: CAP_0201-C83410-014,X5R,0.1UF,10V,10%,LPDB,GENERIC; OriginalSymbolOrigin: (-50,25); XY: (-5025,1550); VER: 1; ROT: 0; PHYS_PAGE: 239; LOCATION: C23913; IP: GENERIC; FP_TECH: LPDB; DRAWING: @RVP1_ADL_SB_ADP_S_DDR5_SODIMM_2DPC_LIB.H55_DG2_2DPC(SCH_1):PAGE410; CDS_LIB: discrete; PCB Footprint: SMC0201IA; CHIPS_PART_NAME: CAP; CDS_PART_NAME: CAP_0201-C83410-014,X5R,0.1UF,10V,10%,LPDB,GENERIC; CDS_LOCATION: C23913
C23914 = CAP: CDS_PHYS_PART_NAME: CAP_0201-C83410-014,X5R,0.1UF,10V,10%,LPDB,GENERIC; OriginalSymbolOrigin: (-50,25); XY: (-5025,750); VER: 1; ROT: 0; PHYS_PAGE: 239; LOCATION: C23914; IP: GENERIC; FP_TECH: LPDB; DRAWING: @RVP1_ADL_SB_ADP_S_DDR5_SODIMM_2DPC_LIB.H55_DG2_2DPC(SCH_1):PAGE410; CDS_LIB: discrete; PCB Footprint: SMC0201IA; CHIPS_PART_NAME: CAP; CDS_PART_NAME: CAP_0201-C83410-014,X5R,0.1UF,10V,10%,LPDB,GENERIC; CDS_LOCATION: C23914
C23915 = CAP: CDS_PHYS_PART_NAME: CAP_0201-C83410-014,X5R,0.1UF,10V,10%,LPDB,GENERIC; OriginalSymbolOrigin: (-50,25); XY: (-4625,1550); VER: 1; ROT: 0; PHYS_PAGE: 239; LOCATION: C23915; IP: GENERIC; FP_TECH: LPDB; DRAWING: @RVP1_ADL_SB_ADP_S_DDR5_SODIMM_2DPC_LIB.H55_DG2_2DPC(SCH_1):PAGE410; CDS_LIB: discrete; PCB Footprint: SMC0201IA; CHIPS_PART_NAME: CAP; CDS_PART_NAME: CAP_0201-C83410-014,X5R,0.1UF,10V,10%,LPDB,GENERIC; CDS_LOCATION: C23915
C23916 = CAP: CDS_PHYS_PART_NAME: CAP_0201-C83410-014,X5R,0.1UF,10V,10%,LPDB,GENERIC; OriginalSymbolOrigin: (-50,25); XY: (-4625,750); VER: 1; ROT: 0; PHYS_PAGE: 239; LOCATION: C23916; IP: GENERIC; FP_TECH: LPDB; DRAWING: @RVP1_ADL_SB_ADP_S_DDR5_SODIMM_2DPC_LIB.H55_DG2_2DPC(SCH_1):PAGE410; CDS_LIB: discrete; PCB Footprint: SMC0201IA; CHIPS_PART_NAME: CAP; CDS_PART_NAME: CAP_0201-C83410-014,X5R,0.1UF,10V,10%,LPDB,GENERIC; CDS_LOCATION: C23916
C23917 = CAP: CDS_PHYS_PART_NAME: CAP_0201-C83410-014,X5R,0.1UF,10V,10%,LPDB,GENERIC; OriginalSymbolOrigin: (-50,25); XY: (-4225,1525); VER: 1; ROT: 0; PHYS_PAGE: 239; LOCATION: C23917; IP: GENERIC; FP_TECH: LPDB; DRAWING: @RVP1_ADL_SB_ADP_S_DDR5_SODIMM_2DPC_LIB.H55_DG2_2DPC(SCH_1):PAGE410; CDS_LIB: discrete; PCB Footprint: SMC0201IA; CHIPS_PART_NAME: CAP; CDS_PART_NAME: CAP_0201-C83410-014,X5R,0.1UF,10V,10%,LPDB,GENERIC; CDS_LOCATION: C23917
C23918 = CAP: CDS_PHYS_PART_NAME: CAP_0201-C83410-014,X5R,0.1UF,10V,10%,LPDB,GENERIC; OriginalSymbolOrigin: (-50,25); XY: (-4225,725); VER: 1; ROT: 0; PHYS_PAGE: 239; LOCATION: C23918; IP: GENERIC; FP_TECH: LPDB; DRAWING: @RVP1_ADL_SB_ADP_S_DDR5_SODIMM_2DPC_LIB.H55_DG2_2DPC(SCH_1):PAGE410; CDS_LIB: discrete; PCB Footprint: SMC0201IA; CHIPS_PART_NAME: CAP; CDS_PART_NAME: CAP_0201-C83410-014,X5R,0.1UF,10V,10%,LPDB,GENERIC; CDS_LOCATION: C23918
C23919 = CAP: CDS_PHYS_PART_NAME: CAP_0201-C83410-014,X5R,0.1UF,10V,10%,LPDB,GENERIC; OriginalSymbolOrigin: (-50,25); XY: (-3825,1525); VER: 1; ROT: 0; PHYS_PAGE: 239; LOCATION: C23919; IP: GENERIC; FP_TECH: LPDB; DRAWING: @RVP1_ADL_SB_ADP_S_DDR5_SODIMM_2DPC_LIB.H55_DG2_2DPC(SCH_1):PAGE410; CDS_LIB: discrete; PCB Footprint: SMC0201IA; CHIPS_PART_NAME: CAP; CDS_PART_NAME: CAP_0201-C83410-014,X5R,0.1UF,10V,10%,LPDB,GENERIC; CDS_LOCATION: C23919
C23920 = CAP: CDS_PHYS_PART_NAME: CAP_0201-C83410-014,X5R,0.1UF,10V,10%,LPDB,GENERIC; OriginalSymbolOrigin: (-50,25); XY: (-3825,725); VER: 1; ROT: 0; PHYS_PAGE: 239; LOCATION: C23920; IP: GENERIC; FP_TECH: LPDB; DRAWING: @RVP1_ADL_SB_ADP_S_DDR5_SODIMM_2DPC_LIB.H55_DG2_2DPC(SCH_1):PAGE410; CDS_LIB: discrete; PCB Footprint: SMC0201IA; CHIPS_PART_NAME: CAP; CDS_PART_NAME: CAP_0201-C83410-014,X5R,0.1UF,10V,10%,LPDB,GENERIC; CDS_LOCATION: C23920
C23921 = CAP: CDS_PHYS_PART_NAME: CAP_0201-C83410-014,X5R,0.1UF,10V,10%,LPDB,GENERIC; OriginalSymbolOrigin: (-50,25); XY: (-3375,1525); VER: 1; ROT: 0; PHYS_PAGE: 239; LOCATION: C23921; IP: GENERIC; FP_TECH: LPDB; DRAWING: @RVP1_ADL_SB_ADP_S_DDR5_SODIMM_2DPC_LIB.H55_DG2_2DPC(SCH_1):PAGE410; CDS_LIB: discrete; PCB Footprint: SMC0201IA; CHIPS_PART_NAME: CAP; CDS_PART_NAME: CAP_0201-C83410-014,X5R,0.1UF,10V,10%,LPDB,GENERIC; CDS_LOCATION: C23921
C23922 = CAP: CDS_PHYS_PART_NAME: CAP_0201-C83410-014,X5R,0.1UF,10V,10%,LPDB,GENERIC; OriginalSymbolOrigin: (-50,25); XY: (-3375,725); VER: 1; ROT: 0; PHYS_PAGE: 239; LOCATION: C23922; IP: GENERIC; FP_TECH: LPDB; DRAWING: @RVP1_ADL_SB_ADP_S_DDR5_SODIMM_2DPC_LIB.H55_DG2_2DPC(SCH_1):PAGE410; CDS_LIB: discrete; PCB Footprint: SMC0201IA; CHIPS_PART_NAME: CAP; CDS_PART_NAME: CAP_0201-C83410-014,X5R,0.1UF,10V,10%,LPDB,GENERIC; CDS_LOCATION: C23922
C23923 = CAP: CDS_PHYS_PART_NAME: CAP_0201-C83410-014,X5R,0.1UF,10V,10%,LPDB,GENERIC; OriginalSymbolOrigin: (-50,25); XY: (-2975,1525); VER: 1; ROT: 0; PHYS_PAGE: 239; LOCATION: C23923; IP: GENERIC; FP_TECH: LPDB; DRAWING: @RVP1_ADL_SB_ADP_S_DDR5_SODIMM_2DPC_LIB.H55_DG2_2DPC(SCH_1):PAGE410; CDS_LIB: discrete; PCB Footprint: SMC0201IA; CHIPS_PART_NAME: CAP; CDS_PART_NAME: CAP_0201-C83410-014,X5R,0.1UF,10V,10%,LPDB,GENERIC; CDS_LOCATION: C23923
C23924 = CAP: CDS_PHYS_PART_NAME: CAP_0201-C83410-014,X5R,0.1UF,10V,10%,LPDB,GENERIC; OriginalSymbolOrigin: (-50,25); XY: (-2975,725); VER: 1; ROT: 0; PHYS_PAGE: 239; LOCATION: C23924; IP: GENERIC; FP_TECH: LPDB; DRAWING: @RVP1_ADL_SB_ADP_S_DDR5_SODIMM_2DPC_LIB.H55_DG2_2DPC(SCH_1):PAGE410; CDS_LIB: discrete; PCB Footprint: SMC0201IA; CHIPS_PART_NAME: CAP; CDS_PART_NAME: CAP_0201-C83410-014,X5R,0.1UF,10V,10%,LPDB,GENERIC; CDS_LOCATION: C23924
C23925 = CAP: CDS_PHYS_PART_NAME: CAP_0201-C83410-014,X5R,0.1UF,10V,10%,LPDB,GENERIC; OriginalSymbolOrigin: (-50,25); XY: (-2550,1525); VER: 1; ROT: 0; PHYS_PAGE: 239; LOCATION: C23925; IP: GENERIC; FP_TECH: LPDB; DRAWING: @RVP1_ADL_SB_ADP_S_DDR5_SODIMM_2DPC_LIB.H55_DG2_2DPC(SCH_1):PAGE410; CDS_LIB: discrete; PCB Footprint: SMC0201IA; CHIPS_PART_NAME: CAP; CDS_PART_NAME: CAP_0201-C83410-014,X5R,0.1UF,10V,10%,LPDB,GENERIC; CDS_LOCATION: C23925
C23926 = CAP: CDS_PHYS_PART_NAME: CAP_0201-C83410-014,X5R,0.1UF,10V,10%,LPDB,GENERIC; OriginalSymbolOrigin: (-50,25); XY: (-2550,725); VER: 1; ROT: 0; PHYS_PAGE: 239; LOCATION: C23926; IP: GENERIC; FP_TECH: LPDB; DRAWING: @RVP1_ADL_SB_ADP_S_DDR5_SODIMM_2DPC_LIB.H55_DG2_2DPC(SCH_1):PAGE410; CDS_LIB: discrete; PCB Footprint: SMC0201IA; CHIPS_PART_NAME: CAP; CDS_PART_NAME: CAP_0201-C83410-014,X5R,0.1UF,10V,10%,LPDB,GENERIC; CDS_LOCATION: C23926
C23927 = CAP: CDS_PHYS_PART_NAME: CAP_0201-C83410-014,X5R,0.1UF,10V,10%,LPDB,GENERIC; OriginalSymbolOrigin: (-50,25); XY: (-2150,1525); VER: 1; ROT: 0; PHYS_PAGE: 239; LOCATION: C23927; IP: GENERIC; FP_TECH: LPDB; DRAWING: @RVP1_ADL_SB_ADP_S_DDR5_SODIMM_2DPC_LIB.H55_DG2_2DPC(SCH_1):PAGE410; CDS_LIB: discrete; PCB Footprint: SMC0201IA; CHIPS_PART_NAME: CAP; CDS_PART_NAME: CAP_0201-C83410-014,X5R,0.1UF,10V,10%,LPDB,GENERIC; CDS_LOCATION: C23927
C23928 = CAP: CDS_PHYS_PART_NAME: CAP_0201-C83410-014,X5R,0.1UF,10V,10%,LPDB,GENERIC; OriginalSymbolOrigin: (-50,25); XY: (-2150,725); VER: 1; ROT: 0; PHYS_PAGE: 239; LOCATION: C23928; IP: GENERIC; FP_TECH: LPDB; DRAWING: @RVP1_ADL_SB_ADP_S_DDR5_SODIMM_2DPC_LIB.H55_DG2_2DPC(SCH_1):PAGE410; CDS_LIB: discrete; PCB Footprint: SMC0201IA; CHIPS_PART_NAME: CAP; CDS_PART_NAME: CAP_0201-C83410-014,X5R,0.1UF,10V,10%,LPDB,GENERIC; CDS_LOCATION: C23928
C23929 = CAP: CDS_PHYS_PART_NAME: CAP_0201-C83410-014,X5R,0.1UF,10V,10%,LPDB,GENERIC; OriginalSymbolOrigin: (-50,25); XY: (-1700,1525); VER: 1; ROT: 0; PHYS_PAGE: 239; LOCATION: C23929; IP: GENERIC; FP_TECH: LPDB; DRAWING: @RVP1_ADL_SB_ADP_S_DDR5_SODIMM_2DPC_LIB.H55_DG2_2DPC(SCH_1):PAGE410; CDS_LIB: discrete; PCB Footprint: SMC0201IA; CHIPS_PART_NAME: CAP; CDS_PART_NAME: CAP_0201-C83410-014,X5R,0.1UF,10V,10%,LPDB,GENERIC; CDS_LOCATION: C23929
C23930 = CAP: CDS_PHYS_PART_NAME: CAP_0201-C83410-014,X5R,0.1UF,10V,10%,LPDB,GENERIC; OriginalSymbolOrigin: (-50,25); XY: (-1700,725); VER: 1; ROT: 0; PHYS_PAGE: 239; LOCATION: C23930; IP: GENERIC; FP_TECH: LPDB; DRAWING: @RVP1_ADL_SB_ADP_S_DDR5_SODIMM_2DPC_LIB.H55_DG2_2DPC(SCH_1):PAGE410; CDS_LIB: discrete; PCB Footprint: SMC0201IA; CHIPS_PART_NAME: CAP; CDS_PART_NAME: CAP_0201-C83410-014,X5R,0.1UF,10V,10%,LPDB,GENERIC; CDS_LOCATION: C23930
C23931 = CAP: CDS_PHYS_PART_NAME: CAP_0201-C83410-014,X5R,0.1UF,10V,10%,LPDB,GENERIC; OriginalSymbolOrigin: (-50,25); XY: (-1300,1525); VER: 1; ROT: 0; PHYS_PAGE: 239; LOCATION: C23931; IP: GENERIC; FP_TECH: LPDB; DRAWING: @RVP1_ADL_SB_ADP_S_DDR5_SODIMM_2DPC_LIB.H55_DG2_2DPC(SCH_1):PAGE410; CDS_LIB: discrete; PCB Footprint: SMC0201IA; CHIPS_PART_NAME: CAP; CDS_PART_NAME: CAP_0201-C83410-014,X5R,0.1UF,10V,10%,LPDB,GENERIC; CDS_LOCATION: C23931
C23932 = CAP: CDS_PHYS_PART_NAME: CAP_0201-C83410-014,X5R,0.1UF,10V,10%,LPDB,GENERIC; OriginalSymbolOrigin: (-50,25); XY: (-1300,725); VER: 1; ROT: 0; PHYS_PAGE: 239; LOCATION: C23932; IP: GENERIC; FP_TECH: LPDB; DRAWING: @RVP1_ADL_SB_ADP_S_DDR5_SODIMM_2DPC_LIB.H55_DG2_2DPC(SCH_1):PAGE410; CDS_LIB: discrete; PCB Footprint: SMC0201IA; CHIPS_PART_NAME: CAP; CDS_PART_NAME: CAP_0201-C83410-014,X5R,0.1UF,10V,10%,LPDB,GENERIC; CDS_LOCATION: C23932